# Altium project 4U_PEE_V100.PrjPcb (part 1 of 3)
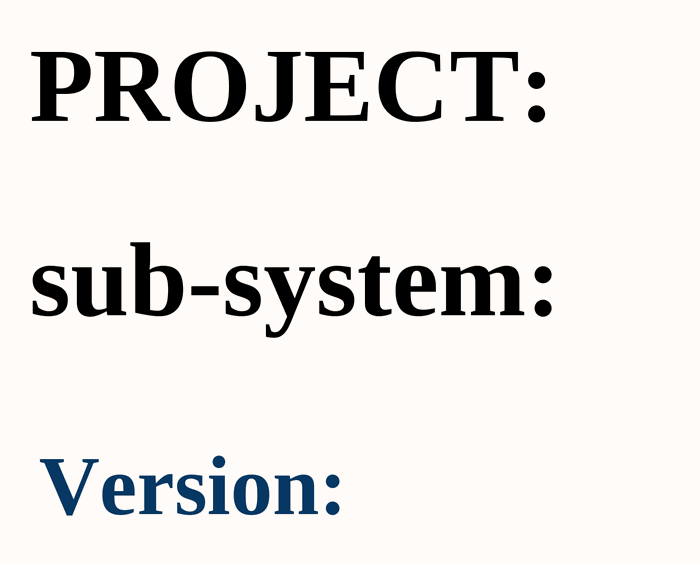
[diagram p0: 01_COVER PAGE.SchDoc]
ApprovedBy: Vu Pham; CheckedBy: Bao Bui; Date: 10/29/2025; DrawnBy: Cam Doan; MasterProject: BEE-PC; Revision: 1.0.0; SubSystem: EXP
21 sheets, 709 parts. Net scope: flat (ports and power ports of the same name join across sheets).
Board file: BEE-PC_EXP_V100.PcbDoc
Sheets:
  01_COVER PAGE.SchDoc
  02_BLOCK DIAGRAM.SchDoc
  03_INDEX.SchDoc
  04_CONNECTOR_IN.SchDoc
  04_CONNECTOR_OUT.SchDoc
  05_POWER.SchDoc
  05_POWER_2.SchDoc
  06_SOM.SchDoc
  06_SOM_USB_CARD.SchDoc
  06_SOM_Console.SchDoc
  07_eMMC.SchDoc
  07_USB.SchDoc
  08_MCU.SchDoc
  09_MRAM_RTC_WDT.SchDoc
  10_NTC_TEMPSENSOR.SchDoc
  11_HEATER.SchDoc
  12_TEC.SchDoc
  13_FLOW_Sensor.SchDoc
  14_HD4_PUMP.SchDoc
  15_SOLEDNOID.SchDoc
  MOUTING.SchDoc

## Sheet 01_COVER PAGE.SchDoc
size 420 x 297 mm; SheetNumber: 1; SheetTotal: 28

### Notes on the sheet
- PROJECT:
- sub-system:
- Version:
- Project:
- Sub-system:
- Design by:
- Sheet title:
- Sheet
- of
- Checked by:
- Approved by:
- Revision:
- Document No:
- Size:
- Date:
- A3

## Sheet 02_BLOCK DIAGRAM.SchDoc
size 420 x 297 mm; SheetNumber: 2; SheetTotal: 28

### Notes on the sheet
- Project:
- Sub-system:
- Design by:
- Sheet title:
- Sheet
- of
- Checked by:
- Approved by:
- Revision:
- Document No:
- Size:
- Date:
- A3

## Sheet 03_INDEX.SchDoc
size 420 x 297 mm; SheetNumber: 3; SheetTotal: 28
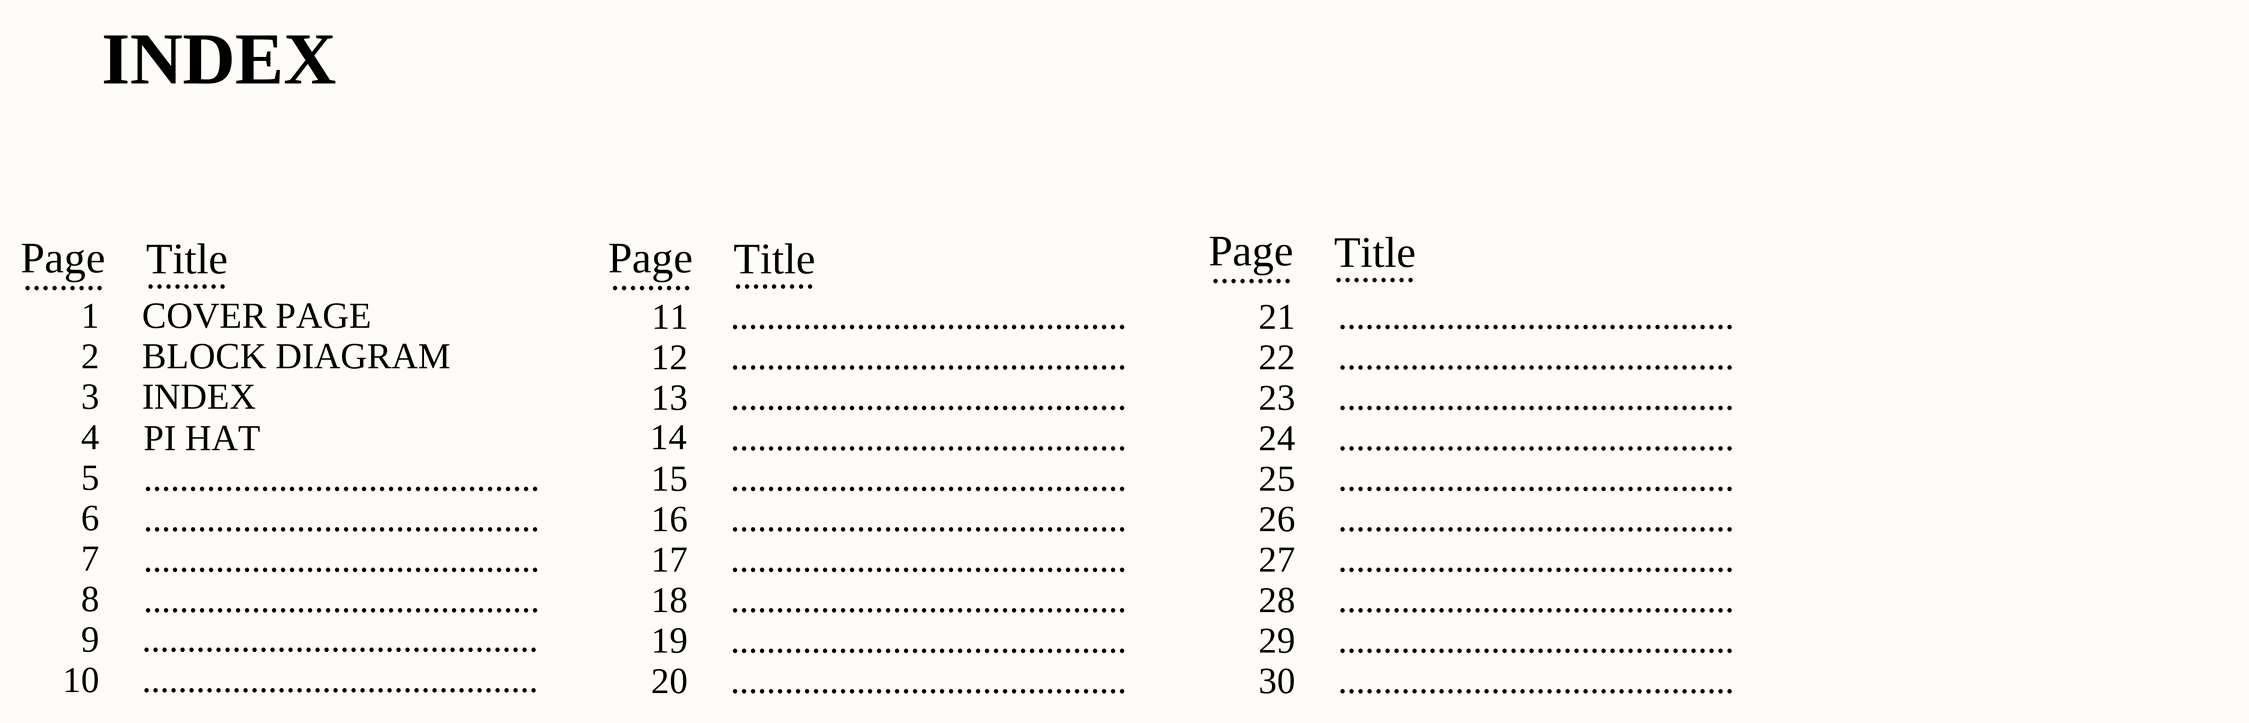
[diagram p1: 03_INDEX.SchDoc]

### Notes on the sheet
- INDEX
- Page
- .........
- Title
- 1
- 2
- COVER PAGE
- BLOCK DIAGRAM
- 11
- 12
- ............................................
- 21
- 22
- 3
- 4
- 14
- 13
- 23
- 5
- PI HAT
- 15
- 24
- 25
- 6
- 7
- 16
- 17
- 26
- 27
- 8
- 18
- 28
- 9
- 10
- 19
- 20
- 29
- 30
- Project:
- Sub-system:
- Design by:
- Sheet title:
- Sheet
- of
- Checked by:
- Approved by:
- Revision:
- Document No:
- Size:
- Date:
- A3

## Sheet 04_CONNECTOR_IN.SchDoc
size 420 x 297 mm; SheetNumber: 4; SheetTotal: 29
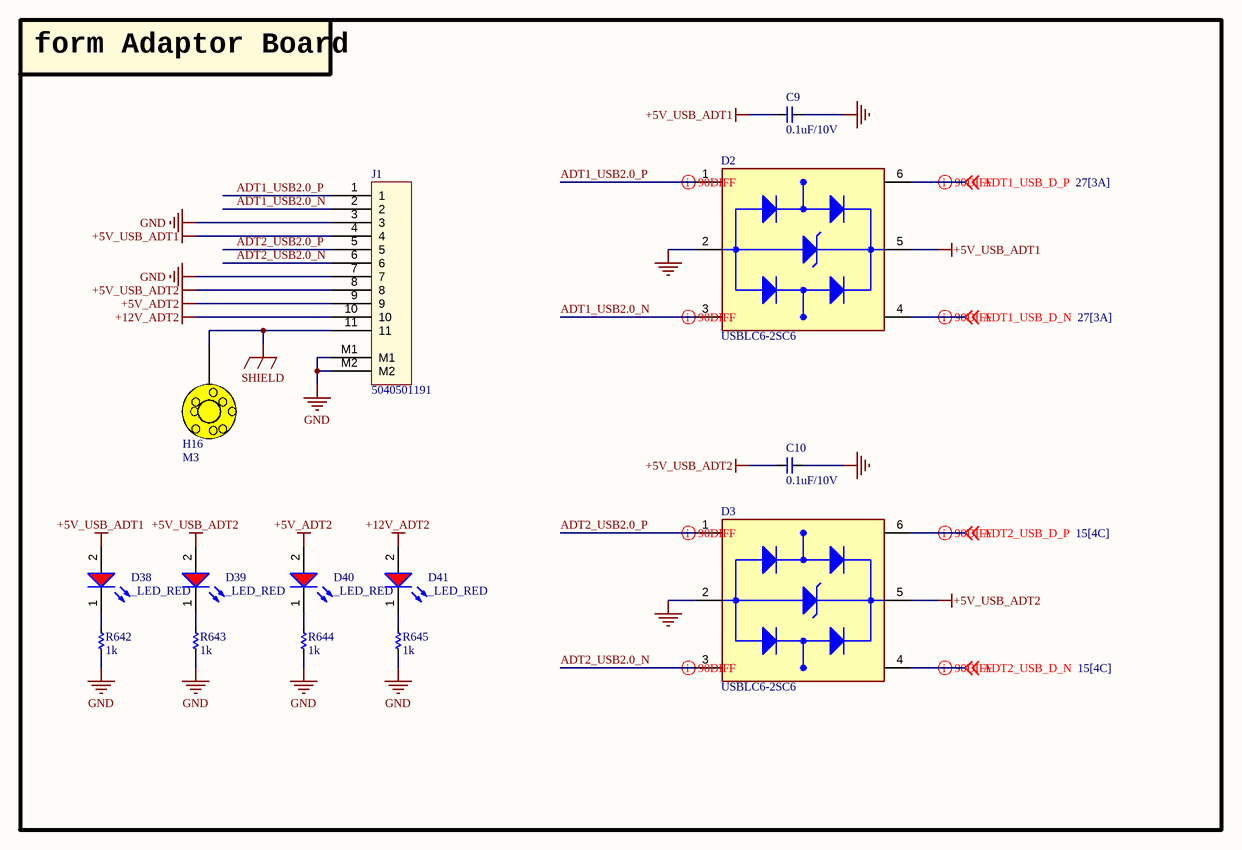
[diagram p2: 04_CONNECTOR_IN.SchDoc]

### Parts
C9  0.1uF/10V  [CAP_C_1005X60]
C10  0.1uF/10V  [CAP_C_1005X60]
D2  USBLC6-2SC6  [SOT95P280X145-6N]
D3  USBLC6-2SC6  [SOT95P280X145-6N]
D38  _LED_RED  [LED_0603]
D39  _LED_RED  [LED_0603]
D40  _LED_RED  [LED_0603]
D41  _LED_RED  [LED_0603]
H16  M3  [Testpoint_TH_D350H250]
J1  5040501191  [MOLEX_5040501191]
R642  1k  [RES_C_1005X40]
R643  1k  [RES_C_1005X40]
R644  1k  [RES_C_1005X40]
R645  1k  [RES_C_1005X40]

### Blocks framed on the sheet
form Adaptor Board: C9 C10 D2 D3 D38-D41 H16 J1 R642-R645

### Nets
+5V_ADT2: D40.2(A) J1.9
+5V_USB_ADT1: C9.2 D2.5(VBUS) D38.2(A) J1.4
+5V_USB_ADT2: C10.2 D3.5(VBUS) D39.2(A) J1.8
+12V_ADT2: D41.2(A) J1.10
GND: C9.1 C10.1 D2.2(GND) D3.2(GND) J1.3 J1.7 J1.M1 J1.M2 R642.1 R643.1 R644.1 R645.1
SHIELD: H16.1 J1.11
ADT1_USB2.0_N: D2.3(I/O2_IN) J1.2
ADT1_USB2.0_P: D2.1(I/O1_IN) J1.1
ADT1_USB_D_N: D2.4(I/O2_OUT) ; off-sheet ADT1_USB_D_N
ADT1_USB_D_P: D2.6(I/O1_OUT) ; off-sheet ADT1_USB_D_P
ADT2_USB2.0_N: D3.3(I/O2_IN) J1.6
ADT2_USB2.0_P: D3.1(I/O1_IN) J1.5
ADT2_USB_D_N: D3.4(I/O2_OUT) ; off-sheet ADT2_USB_D_N
ADT2_USB_D_P: D3.6(I/O1_OUT) ; off-sheet ADT2_USB_D_P
NetD38_1: D38.1(K) R642.2
NetD39_1: D39.1(K) R643.2
NetD40_1: D40.1(K) R644.2
NetD41_1: D41.1(K) R645.2

### Layout directives
differential pair; differential pair class DIFF90: ADT1_USB2.0_N, ADT1_USB2.0_P, ADT1_USB_D_N, ADT1_USB_D_P, ADT2_USB2.0_N, ADT2_USB2.0_P, ADT2_USB_D_N, ADT2_USB_D_P

### Notes on the sheet
- Project:
- Sub-system:
- Design by:
- Sheet title:
- Sheet
- of
- Checked by:
- Approved by:
- Revision:
- Document No:
- Size:
- Date:
- A3

### Library data of the parts
C9 C10 = _CAP_C_2: CAP CHIP
D2 D3 = USBLC6-2SC6: 17V Clamp 5A (8/20Âµs) Ipp Tvs Diode Surface Mount SOT-23-6; MF: STMicroelectronics; Value: *; SnapEDA_Link: https://www.snapeda.com/parts/USBLC6-2SC6/STMicroelectronics/view-part/?ref=snap; Check_prices: https://www.snapeda.com/parts/USBLC6-2SC6/STMicroelectronics/view-part/?ref=eda; Purchase-URL: https://pricing.snapeda.com/search/part/USBLC6-2SC6/?ref=eda; Price: None; Availability: In Stock; Package: SOT-23-6 STMicroelectronics; MP: USBLC6-2SC6
H16 = HEX-M3
J1 = Header 11x1_2M
R642-R645 = _RES_B_2: RES

## Sheet 04_CONNECTOR_OUT.SchDoc
size 420 x 297 mm; SheetNumber: 5; SheetTotal: 28
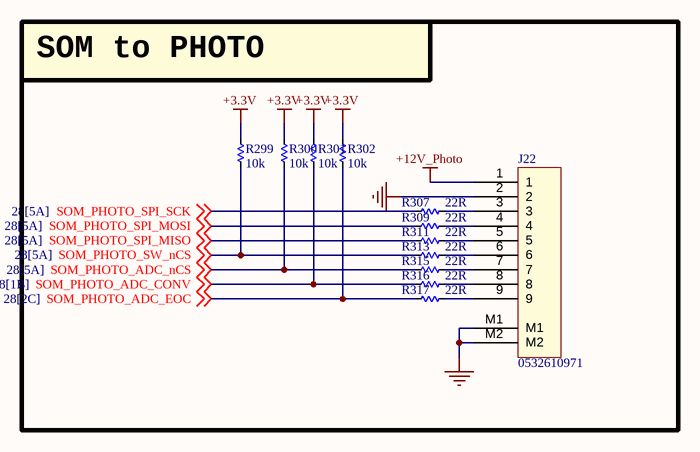
[diagram p3: 04_CONNECTOR_OUT.SchDoc]

### Parts
J22  0532610971  [MOLEX_0532610971]
R299  10k  [RES_C_1005X40]
R300  10k  [RES_C_1005X40]
R301  10k  [RES_C_1005X40]
R302  10k  [RES_C_1005X40]
R307  22R  [RES_C_1005X40]
R309  22R  [RES_C_1005X40]
R311  22R  [RES_C_1005X40]
R313  22R  [RES_C_1005X40]
R315  22R  [RES_C_1005X40]
R316  22R  [RES_C_1005X40]
R317  22R  [RES_C_1005X40]

### Blocks framed on the sheet
SOM to PHOTO: J22 R299-R302 R307 R309 R311 R313 R315-R317

### Nets
+3.3V: R299.1 R300.1 R301.1 R302.1
+12V_Photo: J22.1
GND: J22.2 J22.M1 J22.M2
SOM_PHOTO_ADC_CONV: R301.2 R316.1 ; off-sheet SOM_PHOTO_ADC_CONV
SOM_PHOTO_ADC_EOC: R302.2 R317.1 ; off-sheet SOM_PHOTO_ADC_EOC
SOM_PHOTO_ADC_nCS: R300.2 R315.1 ; off-sheet SOM_PHOTO_ADC_nCS
SOM_PHOTO_SPI_MISO: R311.1 ; off-sheet SOM_PHOTO_SPI_MISO
SOM_PHOTO_SPI_MOSI: R309.1 ; off-sheet SOM_PHOTO_SPI_MOSI
SOM_PHOTO_SPI_SCK: R307.1 ; off-sheet SOM_PHOTO_SPI_SCK
SOM_PHOTO_SW_nCS: R299.2 R313.1 ; off-sheet SOM_PHOTO_SW_nCS
NetJ22_3: J22.3 R307.2
NetJ22_4: J22.4 R309.2
NetJ22_5: J22.5 R311.2
NetJ22_6: J22.6 R313.2
NetJ22_7: J22.7 R315.2
NetJ22_8: J22.8 R316.2
NetJ22_9: J22.9 R317.2

### Notes on the sheet
- Project:
- Sub-system:
- Design by:
- Sheet title:
- Sheet
- of
- Checked by:
- Approved by:
- Revision:
- Document No:
- Size:
- Date:
- A3

### Library data of the parts
J22 = Header 9x1_2M
R299-R302 R307 R309 R311 R313 R315-R317 = _RES_B_2: RES

## Sheet 05_POWER.SchDoc
size 420 x 297 mm; SheetNumber: 7; SheetTotal: 28
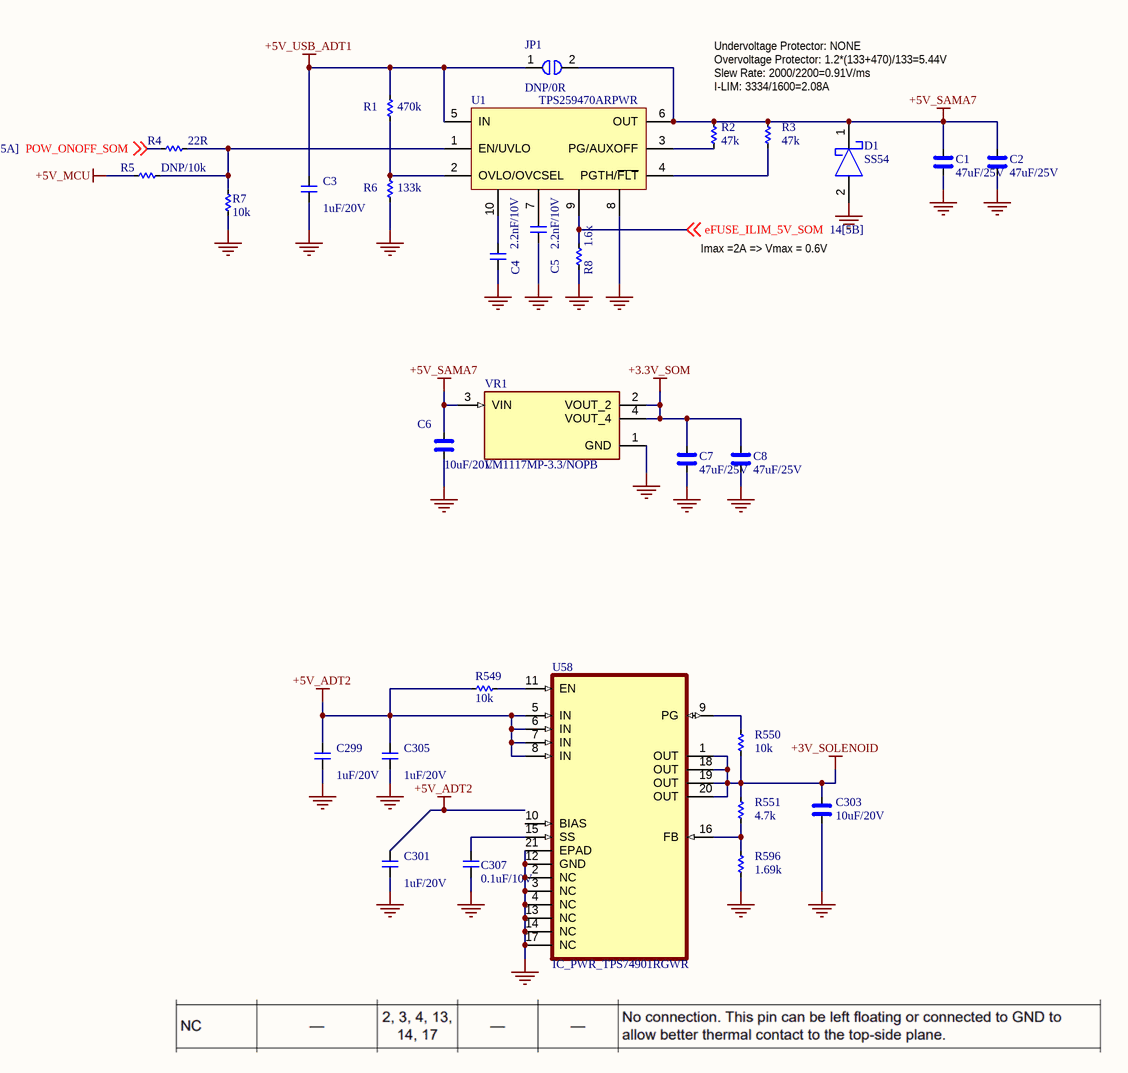
[diagram p4: 05_POWER.SchDoc]

### Parts
C1  47uF/25V  [CAP_C_3225X80]
C2  47uF/25V  [CAP_C_3225X80]
C3  1uF/20V  [CAP_C_1005X60]
C4  2.2nF/10V  [CAP_C_1005X60]
C5  2.2nF/10V  [CAP_C_1005X60]
C6  10uF/20V  [CAP_C_2012X110]
C7  47uF/25V  [CAP_C_3225X80]
C8  47uF/25V  [CAP_C_3225X80]
C299  1uF/20V  [CAP_C_1005X60]
C301  1uF/20V  [CAP_C_1005X60]
C303  10uF/20V  [CAP_C_2012X110]
C305  1uF/20V  [CAP_C_1005X60]
C307  0.1uF/10V  [CAP_C_1005X60]
D1  SS54  [DO-214AC_SMA]
JP1  DNP/0R  [RES_C_1608X60]
R1  470k  [RES_C_1005X40]
R2  47k  [RES_C_1005X40]
R3  47k  [RES_C_1005X40]
R4  22R  [RES_C_1005X40]
R5  DNP/10k  [RES_C_1005X40]
R6  133k  [RES_C_1005X40]
R7  10k  [RES_C_1005X40]
R8  1.6k  [RES_C_1005X40]
R549  10k  [RES_C_1005X40]
R550  10k  [RES_C_1005X40]
R551  4.7k  [RES_C_1005X40]
R596  1.69k  [RES_C_1005X40]
U1  TPS259470ARPWR  [VQFN-HR-10]
U58  IC_PWR_TPS74901RGWR  [QFN65P500X500X100-21N]
VR1  LM1117MP-3.3/NOPB  [VREG_LM1117MP-3.3/NOPB]

### Nets
+3.3V_SOM: C7.2 C8.2 VR1.2(VOUT_2) VR1.4(VOUT_4)
+3V_SOLENOID: C303.1 R550.1 R551.2 U58.1(OUT) U58.18(OUT) U58.19(OUT) U58.20(OUT)
+5V_ADT2: C299.2 C301.2 C305.2 R549.2 U58.5(IN) U58.6(IN) U58.7(IN) U58.8(IN)
+5V_MCU: R5.2
+5V_SAMA7: C1.2 C2.2 C6.1 D1.1 JP1.2 R2.2 R3.2 U1.6(OUT) VR1.3(VIN)
+5V_USB_ADT1: C3.2 JP1.1 R1.2 U1.5(IN)
GND: C1.1 C2.1 C3.1 C4.1 C5.1 C6.2 C7.1 C8.1 C299.1 C301.1 C303.2 C305.1 C307.1 D1.2 R6.1 R7.2 R8.1 R596.1 U1.8 U58.2(NC) U58.3(NC) U58.4(NC) U58.12(GND) U58.13(NC) U58.14(NC) U58.17(NC) U58.21(EPAD) VR1.1(GND)
eFUSE_ILIM_5V_SOM: R8.2 U1.9 ; off-sheet eFUSE_ILIM_5V_SOM
POW_ONOFF_SOM: R4.2 ; off-sheet POW_ONOFF_SOM
NetC4_2: C4.2 U1.10
NetC5_2: C5.2 U1.7
NetC307_2: C307.2 U58.15(SS)
NetR1_1: R1.1 R6.2 U1.2(OVLO/OVCSEL)
NetR2_1: R2.1 U1.3(PG/AUXOFF)
NetR3_1: R3.1 U1.4(PGTH/~{FLT})
NetR4_1: R4.1 R5.1 R7.1 U1.1(EN/UVLO)
NetR549_1: R549.1 U58.11(EN)
NetR550_2: R550.2 U58.9(PG)
NetR551_1: R551.1 R596.2 U58.16(FB)

Not connected (* = marked no-connect by the designer): U58 10(BIAS)

### Notes on the sheet
- Undervoltage Protector: NONE
- Overvoltage Protector: 1.2*(133+470)/133=5.44V
- Slew Rate: 2000/2200=0.91V/ms
- I-LIM: 3334/1600=2.08A
- Imax =2A => Vmax = 0.6V
- Project:
- Sub-system:
- Design by:
- Sheet title:
- Sheet
- of
- Checked by:
- Approved by:
- Revision:
- Document No:
- Size:
- Date:
- A3

### Library data of the parts
C1 C2 C6-C8 C303 = _CAP_C_High_2: CAP CHIP High Value
C3-C5 C299 C301 C305 C307 = _CAP_C_2: CAP CHIP
D1 = SS54: DIODE SCHOTTKY 60V 3A DO214AA
JP1 = JUMPER_1_1
R1-R8 R549-R551 R596 = _RES_B_2: RES
U58 = IC_PWR_TPS74901RGWR: 3-A, low-VIN (0.8-V), adjustable ultra-low-dropout voltage regulator with power good & enable 20-VQFN -40 to 125; MF: Texas Instruments; Price: None; Check_prices: https://www.snapeda.com/parts/TPS74901RGWR/Texas%20Instruments/view-part/1101342/?ref=eda; SnapEDA_Link: https://www.snapeda.com/parts/TPS74901RGWR/Texas%20Instruments/view-part/1101342/?ref=snap; Package: VQFN-20 Texas Instruments; Purchase-URL: https://pricing.snapeda.com/search/part/TPS74901RGWR/?ref=eda; Availability: Good; MP: TPS74901RGWR; Value: *
VR1 = LM1117MP-3.3/NOPB: 800-mA 15-V linear voltage regulator; MF: Texas Instruments; SnapEDA_Link: https://www.snapeda.com/parts/LM1117MP-3.3/NOPB/Texas+Instruments/view-part/?ref=snap; Package: SOT-223-4 Texas Instruments; Value: *; MP: LM1117MP-3.3/NOPB; Check_prices: https://www.snapeda.com/parts/LM1117MP-3.3/NOPB/Texas+Instruments/view-part/?ref=eda

## Sheet 05_POWER_2.SchDoc
size 420 x 297 mm; SheetNumber: 8; SheetTotal: 28
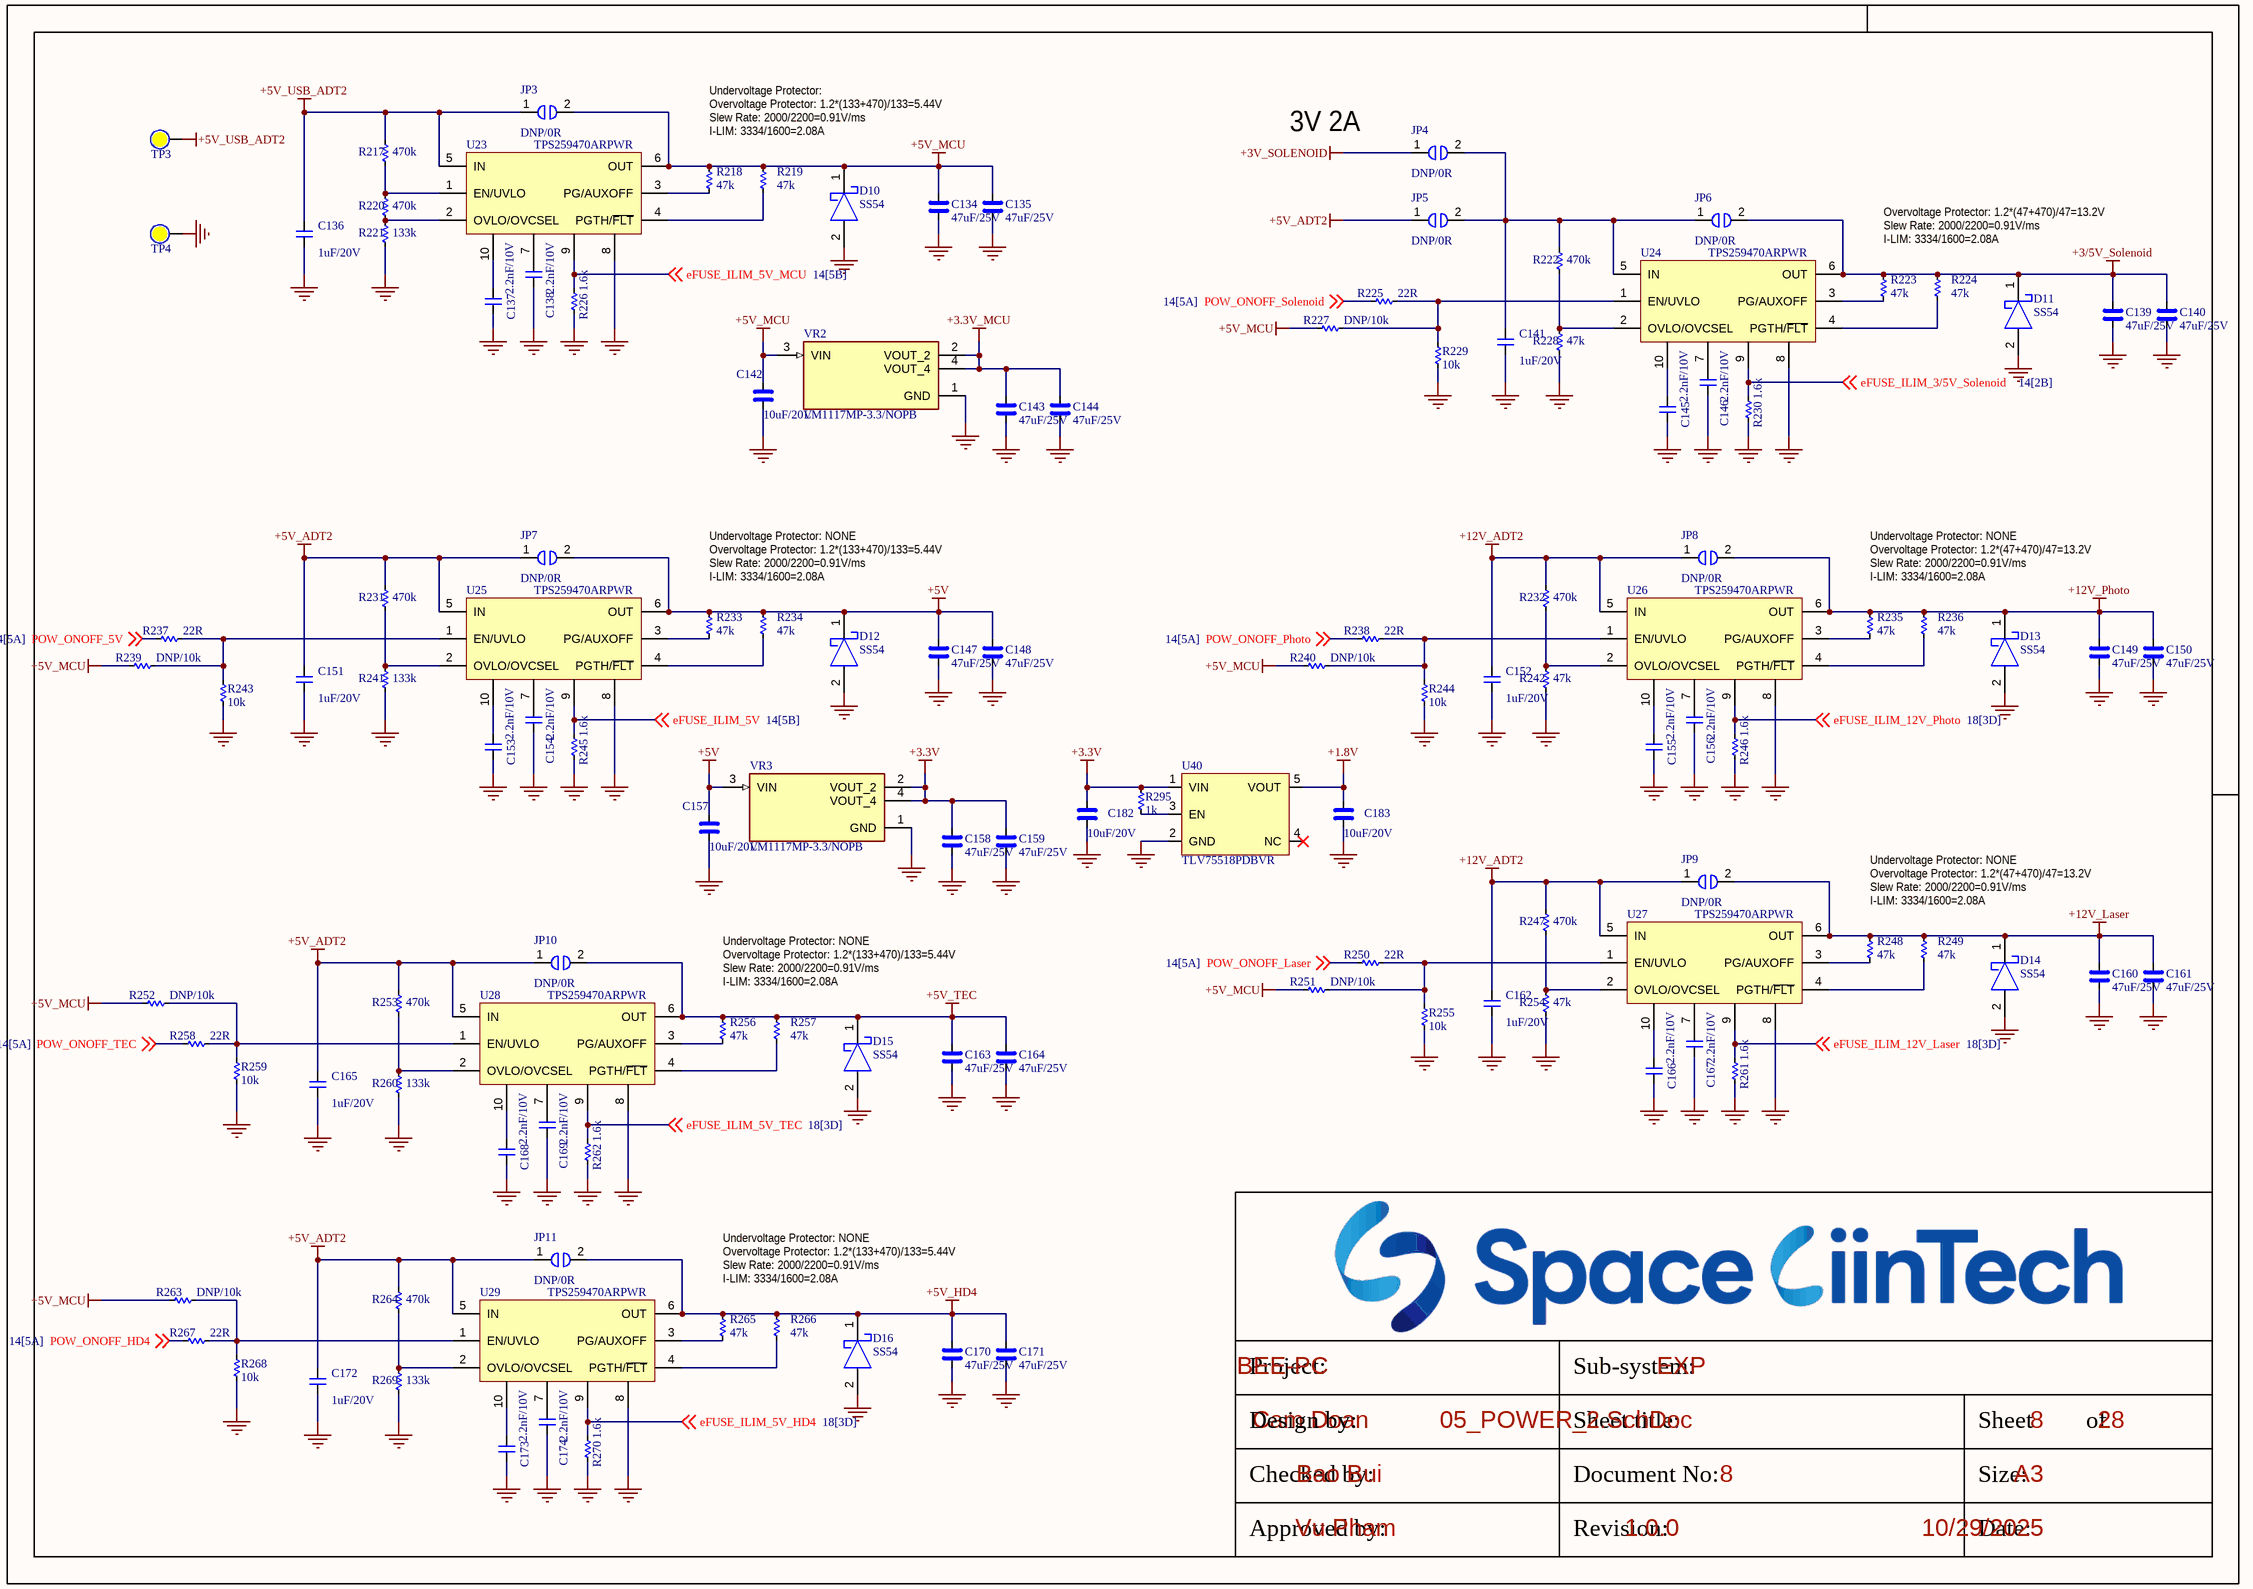
[diagram p5: 05_POWER_2.SchDoc]

### Parts
C134  47uF/25V  [CAP_C_3225X80]
C135  47uF/25V  [CAP_C_3225X80]
C136  1uF/20V  [CAP_C_1005X60]
C137  2.2nF/10V  [CAP_C_1005X60]
C138  2.2nF/10V  [CAP_C_1005X60]
C139  47uF/25V  [CAP_C_3225X80]
C140  47uF/25V  [CAP_C_3225X80]
C141  1uF/20V  [CAP_C_1005X60]
C142  10uF/20V  [CAP_C_2012X110]
C143  47uF/25V  [CAP_C_3225X80]
C144  47uF/25V  [CAP_C_3225X80]
C145  2.2nF/10V  [CAP_C_1005X60]
C146  2.2nF/10V  [CAP_C_1005X60]
C147  47uF/25V  [CAP_C_3225X80]
C148  47uF/25V  [CAP_C_3225X80]
C149  47uF/25V  [CAP_C_3225X80]
C150  47uF/25V  [CAP_C_3225X80]
C151  1uF/20V  [CAP_C_1005X60]
C152  1uF/20V  [CAP_C_1005X60]
C153  2.2nF/10V  [CAP_C_1005X60]
C154  2.2nF/10V  [CAP_C_1005X60]
C155  2.2nF/10V  [CAP_C_1005X60]
C156  2.2nF/10V  [CAP_C_1005X60]
C157  10uF/20V  [CAP_C_2012X110]
C158  47uF/25V  [CAP_C_3225X80]
C159  47uF/25V  [CAP_C_3225X80]
C160  47uF/25V  [CAP_C_3225X80]
C161  47uF/25V  [CAP_C_3225X80]
C162  1uF/20V  [CAP_C_1005X60]
C163  47uF/25V  [CAP_C_3225X80]
C164  47uF/25V  [CAP_C_3225X80]
C165  1uF/20V  [CAP_C_1005X60]
C166  2.2nF/10V  [CAP_C_1005X60]
C167  2.2nF/10V  [CAP_C_1005X60]
C168  2.2nF/10V  [CAP_C_1005X60]
C169  2.2nF/10V  [CAP_C_1005X60]
C170  47uF/25V  [CAP_C_3225X80]
C171  47uF/25V  [CAP_C_3225X80]
C172  1uF/20V  [CAP_C_1005X60]
C173  2.2nF/10V  [CAP_C_1005X60]
C174  2.2nF/10V  [CAP_C_1005X60]
C182  10uF/20V  [CAP_C_2012X110]
C183  10uF/20V  [CAP_C_2012X110]
D10  SS54  [DO-214AC_SMA]
D11  SS54  [DO-214AC_SMA]
D12  SS54  [DO-214AC_SMA]
D13  SS54  [DO-214AC_SMA]
D14  SS54  [DO-214AC_SMA]
D15  SS54  [DO-214AC_SMA]
D16  SS54  [DO-214AC_SMA]
JP3  DNP/0R  [RES_C_1608X60]
JP4  DNP/0R  [RES_C_1608X60]
JP5  DNP/0R  [RES_C_1608X60]
JP6  DNP/0R  [RES_C_1608X60]
JP7  DNP/0R  [RES_C_1608X60]
JP8  DNP/0R  [RES_C_1608X60]
JP9  DNP/0R  [RES_C_1608X60]
JP10  DNP/0R  [RES_C_1608X60]
JP11  DNP/0R  [RES_C_1608X60]
R217  470k  [RES_C_1005X40]
R218  47k  [RES_C_1005X40]
R219  47k  [RES_C_1005X40]
R220  470k  [RES_C_1005X40]
R221  133k  [RES_C_1005X40]
R222  470k  [RES_C_1005X40]
R223  47k  [RES_C_1005X40]
R224  47k  [RES_C_1005X40]
R225  22R  [RES_C_1005X40]
R226  1.6k  [RES_C_1005X40]
R227  DNP/10k  [RES_C_1005X40]
R228  47k  [RES_C_1005X40]
R229  10k  [RES_C_1005X40]
R230  1.6k  [RES_C_1005X40]
R231  470k  [RES_C_1005X40]
R232  470k  [RES_C_1005X40]
R233  47k  [RES_C_1005X40]
R234  47k  [RES_C_1005X40]
R235  47k  [RES_C_1005X40]
R236  47k  [RES_C_1005X40]
R237  22R  [RES_C_1005X40]
R238  22R  [RES_C_1005X40]
R239  DNP/10k  [RES_C_1005X40]
R240  DNP/10k  [RES_C_1005X40]
R241  133k  [RES_C_1005X40]
R242  47k  [RES_C_1005X40]
R243  10k  [RES_C_1005X40]
R244  10k  [RES_C_1005X40]
R245  1.6k  [RES_C_1005X40]
R246  1.6k  [RES_C_1005X40]
R247  470k  [RES_C_1005X40]
R248  47k  [RES_C_1005X40]
R249  47k  [RES_C_1005X40]
R250  22R  [RES_C_1005X40]
R251  DNP/10k  [RES_C_1005X40]
R252  DNP/10k  [RES_C_1005X40]
R253  470k  [RES_C_1005X40]
R254  47k  [RES_C_1005X40]
R255  10k  [RES_C_1005X40]
R256  47k  [RES_C_1005X40]
R257  47k  [RES_C_1005X40]
R258  22R  [RES_C_1005X40]
R259  10k  [RES_C_1005X40]
R260  133k  [RES_C_1005X40]
R261  1.6k  [RES_C_1005X40]
R262  1.6k  [RES_C_1005X40]
R263  DNP/10k  [RES_C_1005X40]
R264  470k  [RES_C_1005X40]
R265  47k  [RES_C_1005X40]
R266  47k  [RES_C_1005X40]
R267  22R  [RES_C_1005X40]
R268  10k  [RES_C_1005X40]
R269  133k  [RES_C_1005X40]
R270  1.6k  [RES_C_1005X40]
R295  1k  [RES_C_1005X40]
TP3  (no value)  [Testpoint_TH_D130H80]  (no BOM)
TP4  (no value)  [Testpoint_TH_D130H80]  (no BOM)
U23  TPS259470ARPWR  [VQFN-HR-10]
U24  TPS259470ARPWR  [VQFN-HR-10]
U25  TPS259470ARPWR  [VQFN-HR-10]
U26  TPS259470ARPWR  [VQFN-HR-10]
U27  TPS259470ARPWR  [VQFN-HR-10]
U28  TPS259470ARPWR  [VQFN-HR-10]
U29  TPS259470ARPWR  [VQFN-HR-10]
U40  TLV75518PDBVR  [SOT25]
VR2  LM1117MP-3.3/NOPB  [VREG_LM1117MP-3.3/NOPB]
VR3  LM1117MP-3.3/NOPB  [VREG_LM1117MP-3.3/NOPB]

### Nets
+1.8V: C183.1 U40.5(VOUT)
+3.3V: C158.2 C159.2 C182.1 R295.2 U40.1(VIN) VR3.2(VOUT_2) VR3.4(VOUT_4)
+3.3V_MCU: C143.2 C144.2 VR2.2(VOUT_2) VR2.4(VOUT_4)
+3/5V_Solenoid: C139.2 C140.2 D11.1 JP6.2 R223.2 R224.2 U24.6(OUT)
+3V_SOLENOID: JP4.1
+5V: C147.2 C148.2 C157.1 D12.1 JP7.2 R233.2 R234.2 U25.6(OUT) VR3.3(VIN)
+5V_ADT2: C151.2 C165.2 C172.2 JP5.1 JP7.1 JP10.1 JP11.1 R231.2 R253.2 R264.2 U25.5(IN) U28.5(IN) U29.5(IN)
+5V_HD4: C170.2 C171.2 D16.1 JP11.2 R265.2 R266.2 U29.6(OUT)
+5V_MCU: C134.2 C135.2 C142.1 D10.1 JP3.2 R218.2 R219.2 R227.2 R239.2 R240.2 R251.2 R252.2 R263.2 U23.6(OUT) VR2.3(VIN)
+5V_TEC: C163.2 C164.2 D15.1 JP10.2 R256.2 R257.2 U28.6(OUT)
+5V_USB_ADT2: C136.2 JP3.1 R217.2 TP3.0 U23.5(IN)
+12V_ADT2: C152.2 C162.2 JP8.1 JP9.1 R232.2 R247.2 U26.5(IN) U27.5(IN)
+12V_Laser: C160.2 C161.2 D14.1 JP9.2 R248.2 R249.2 U27.6(OUT)
+12V_Photo: C149.2 C150.2 D13.1 JP8.2 R235.2 R236.2 U26.6(OUT)
GND: C134.1 C135.1 C136.1 C137.1 C138.1 C139.1 C140.1 C141.1 C142.2 C143.1 C144.1 C145.1 C146.1 C147.1 C148.1 C149.1 C150.1 C151.1 C152.1 C153.1 C154.1 C155.1 C156.1 C157.2 C158.1 C159.1 C160.1 C161.1 C162.1 C163.1 C164.1 C165.1 C166.1 C167.1 C168.1 C169.1 C170.1 C171.1 C172.1 C173.1 C174.1 C182.2 C183.2 D10.2 D11.2 D12.2 D13.2 D14.2 D15.2 D16.2 R221.1 R226.1 R228.1 R229.2 R230.1 R241.1 R242.1 R243.2 R244.2 R245.1 R246.1 R254.1 R255.2 R259.2 R260.1 R261.1 R262.1 R268.2 R269.1 R270.1 TP4.0 U23.8 U24.8 U25.8 U26.8 U27.8 U28.8 U29.8 U40.2(GND) VR2.1(GND) VR3.1(GND)
eFUSE_ILIM_3/5V_Solenoid: R230.2 U24.9 ; off-sheet eFUSE_ILIM_3/5V_Solenoid
eFUSE_ILIM_5V: R245.2 U25.9 ; off-sheet eFUSE_ILIM_5V
eFUSE_ILIM_5V_HD4: R270.2 U29.9 ; off-sheet eFUSE_ILIM_5V_HD4
eFUSE_ILIM_5V_MCU: R226.2 U23.9 ; off-sheet eFUSE_ILIM_5V_MCU
eFUSE_ILIM_5V_TEC: R262.2 U28.9 ; off-sheet eFUSE_ILIM_5V_TEC
eFUSE_ILIM_12V_Laser: R261.2 U27.9 ; off-sheet eFUSE_ILIM_12V_Laser
eFUSE_ILIM_12V_Photo: R246.2 U26.9 ; off-sheet eFUSE_ILIM_12V_Photo
POW_ONOFF_5V: R237.2 ; off-sheet POW_ONOFF_5V
POW_ONOFF_HD4: R267.2 ; off-sheet POW_ONOFF_HD4
POW_ONOFF_Laser: R250.2 ; off-sheet POW_ONOFF_Laser
POW_ONOFF_Photo: R238.2 ; off-sheet POW_ONOFF_Photo
POW_ONOFF_Solenoid: R225.2 ; off-sheet POW_ONOFF_Solenoid
POW_ONOFF_TEC: R258.2 ; off-sheet POW_ONOFF_TEC
NetC137_2: C137.2 U23.10
NetC138_2: C138.2 U23.7
NetC141_2: C141.2 JP4.2 JP5.2 JP6.1 R222.2 U24.5(IN)
NetC145_2: C145.2 U24.10
NetC146_2: C146.2 U24.7
NetC153_2: C153.2 U25.10
NetC154_2: C154.2 U25.7
NetC155_2: C155.2 U26.10
NetC156_2: C156.2 U26.7
NetC166_2: C166.2 U27.10
NetC167_2: C167.2 U27.7
NetC168_2: C168.2 U28.10
NetC169_2: C169.2 U28.7
NetC173_2: C173.2 U29.10
NetC174_2: C174.2 U29.7
NetR217_1: R217.1 R220.2 U23.1(EN/UVLO)
NetR218_1: R218.1 U23.3(PG/AUXOFF)
NetR219_1: R219.1 U23.4(PGTH/~{FLT})
NetR220_1: R220.1 R221.2 U23.2(OVLO/OVCSEL)
NetR222_1: R222.1 R228.2 U24.2(OVLO/OVCSEL)
NetR223_1: R223.1 U24.3(PG/AUXOFF)
NetR224_1: R224.1 U24.4(PGTH/~{FLT})
NetR225_1: R225.1 R227.1 R229.1 U24.1(EN/UVLO)
NetR231_1: R231.1 R241.2 U25.2(OVLO/OVCSEL)
NetR232_1: R232.1 R242.2 U26.2(OVLO/OVCSEL)
NetR233_1: R233.1 U25.3(PG/AUXOFF)
NetR234_1: R234.1 U25.4(PGTH/~{FLT})
NetR235_1: R235.1 U26.3(PG/AUXOFF)
NetR236_1: R236.1 U26.4(PGTH/~{FLT})
NetR237_1: R237.1 R239.1 R243.1 U25.1(EN/UVLO)
NetR238_1: R238.1 R240.1 R244.1 U26.1(EN/UVLO)
NetR247_1: R247.1 R254.2 U27.2(OVLO/OVCSEL)
NetR248_1: R248.1 U27.3(PG/AUXOFF)
NetR249_1: R249.1 U27.4(PGTH/~{FLT})
NetR250_1: R250.1 R251.1 R255.1 U27.1(EN/UVLO)
NetR252_1: R252.1 R258.1 R259.1 U28.1(EN/UVLO)
NetR253_1: R253.1 R260.2 U28.2(OVLO/OVCSEL)
NetR256_1: R256.1 U28.3(PG/AUXOFF)
NetR257_1: R257.1 U28.4(PGTH/~{FLT})
NetR263_1: R263.1 R267.1 R268.1 U29.1(EN/UVLO)
NetR264_1: R264.1 R269.2 U29.2(OVLO/OVCSEL)
NetR265_1: R265.1 U29.3(PG/AUXOFF)
NetR266_1: R266.1 U29.4(PGTH/~{FLT})
NetR295_1: R295.1 U40.3(EN)

Not connected (* = marked no-connect by the designer): U40 4(NC)*

### Notes on the sheet
- Undervoltage Protector:
- Overvoltage Protector: 1.2*(133+470)/133=5.44V
- Slew Rate: 2000/2200=0.91V/ms
- I-LIM: 3334/1600=2.08A
- 3V 2A
- Overvoltage Protector: 1.2*(47+470)/47=13.2V
- Undervoltage Protector: NONE
- Project:
- Sub-system:
- Design by:
- Sheet title:
- Sheet
- of
- Checked by:
- Approved by:
- Revision:
- Document No:
- Size:
- Date:
- A3

### Library data of the parts
C134 C135 C139 C140 C142-C144 C147-C150 C157-C161 C163 C164 C170 C171 C182 C183 = _CAP_C_High_2: CAP CHIP High Value
C136-C138 C141 C145 C146 C151-C156 C162 C165-C169 C172-C174 = _CAP_C_2: CAP CHIP
D10-D16 = SS54: DIODE SCHOTTKY 60V 3A DO214AA
JP3-JP11 = JUMPER_1_1
R217-R270 R295 = _RES_B_2: RES
TP3 TP4 = Test Point: Solder: NF
U40 = IC_POWER_AP7347DQ
VR2 VR3 = LM1117MP-3.3/NOPB: as VR1 on sheet 05_POWER; SnapEDA_Link: https://www.snapeda.com/parts/LM1117MP-3.3/NOPB/Texas+Instruments/view-part/?ref=snap; Package: SOT-223-4 Texas Instruments; Value: *; MP: LM1117MP-3.3/NOPB; Check_prices: https://www.snapeda.com/parts/LM1117MP-3.3/NOPB/Texas+Instruments/view-part/?ref=eda

## Sheet 06_SOM.SchDoc
size 420 x 297 mm; SheetNumber: 9; SheetTotal: 29
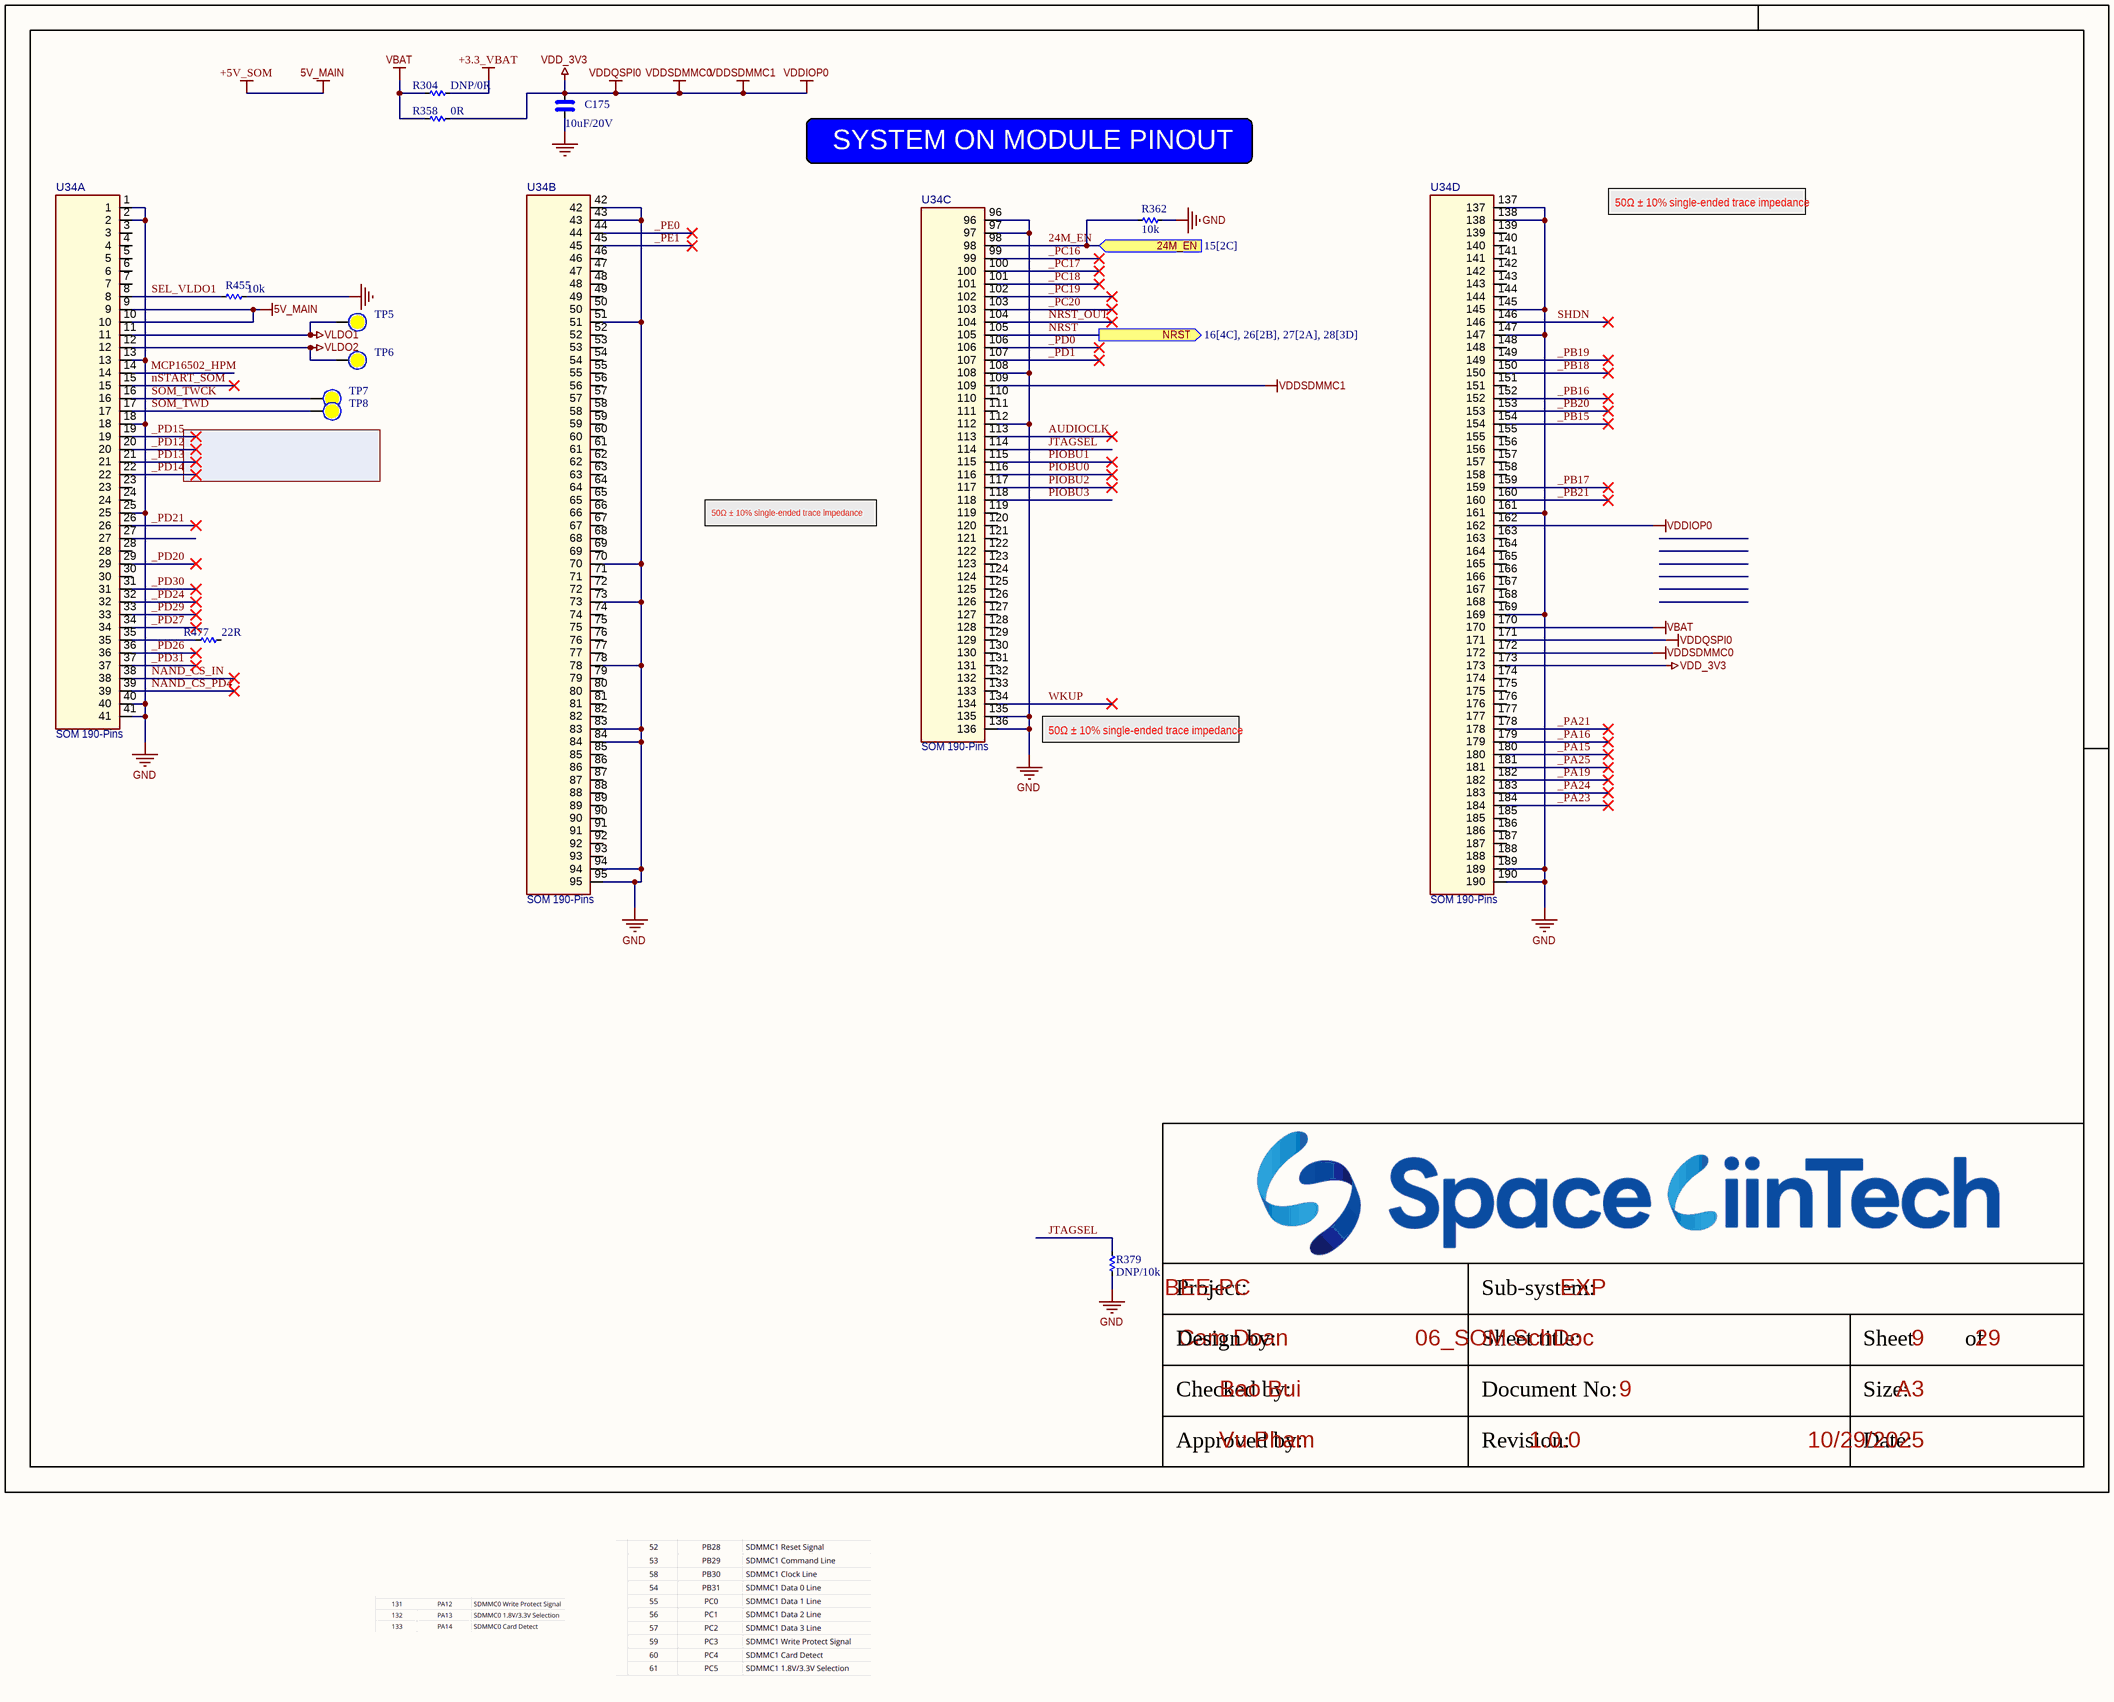
[diagram p6: 06_SOM.SchDoc]

### Parts
C175  10uF/20V  [CAP_C_2012X110]
R304  DNP/0R  [RES_C_1005X40]
R358  0R  [RES_C_1005X40]
R362  10k  [RES_C_1005X40]
R379  DNP/10k  [RES_C_1005X40]
R455  10k  [RES_C_1005X40]
R477  22R  [RES_C_1005X40]
TP5  (no value)  [Testpoint_TH_D130H80]  (no BOM)
TP6  (no value)  [Testpoint_TH_D130H80]  (no BOM)
TP7  (no value)  [Testpoint_TH_D130H80]  (no BOM)
TP8  (no value)  [Testpoint_TH_D130H80]  (no BOM)
U34  SOM 190-Pins  [SOM-38MMX30MM]  (parts A,B,C,D of 4)  (no BOM)

### Ports
24M_EN (in, see 15[2C]), NRST (out, see 16[4C], 26[2B], 27[2A], 28[3D])

### Nets
+3.3_VBAT: R304.1
+5V_SOM: U34.9 U34.10  [also labelled 5V_MAIN]
GND: C175.2 R362.1 R379.1 R455.1 U34.1 U34.2 U34.13 U34.18 U34.25 U34.40 U34.41 U34.42 U34.43 U34.51 U34.70 U34.73 U34.78 U34.83 U34.84 U34.94 U34.95 U34.96 U34.97 U34.108 U34.112 U34.135 U34.136 U34.137 U34.138 U34.145 U34.147 U34.161 U34.169 U34.189 U34.190
VBAT: R304.2 R358.2 U34.170
VDD_3V3: C175.1 R358.1 U34.109 U34.162 U34.171 U34.172 U34.173  [also labelled VDDIOP0, VDDQSPI0, VDDSDMMC0, VDDSDMMC1]
VLDO1: TP5.0 U34.11
VLDO2: TP6.0 U34.12
24M_EN: R362.2 U34.98 ; port 24M_EN
_PA15: U34.180
_PA16: U34.179
_PA19: U34.182
_PA21: U34.178
_PA23: U34.184
_PA24: U34.183
_PA25: U34.181
_PB15: U34.154
_PB16: U34.152
_PB17: U34.159
_PB18: U34.150
_PB19: U34.149
_PB20: U34.153
_PB21: U34.160
_PC16: U34.99
_PC17: U34.100
_PC18: U34.101
_PC19: U34.102
_PC20: U34.103
_PD0: U34.106
_PD1: U34.107
_PD12: U34.20
_PD13: U34.21
_PD14: U34.22
_PD15: U34.19
_PD20: U34.29
_PD21: U34.26
_PD24: U34.32
_PD26: U34.36
_PD27: U34.34
_PD29: U34.33
_PD30: U34.31
_PD31: U34.37
_PE0: U34.44
_PE1: U34.45
AUDIOCLK: U34.113
JTAGSEL: R379.2 U34.114
MCP16502_HPM: U34.14
NAND_CS_IN: U34.38
NAND_CS_PD4: U34.39
NRST: U34.105 ; port NRST
NRST_OUT: U34.104
nSTART_SOM: U34.15
PIOBU0: U34.116
PIOBU1: U34.115
PIOBU2: U34.117
PIOBU3: U34.118
SEL_VLDO1: R455.2 U34.8
SHDN: U34.146
SOM_TWCK: TP7.0 U34.16
SOM_TWD: TP8.0 U34.17
WKUP: U34.134
NetR477_2: R477.2 U34.35

Not connected (* = marked no-connect by the designer): R477 1; U34 3 4 5 6 7 23 24 27 28 30 46 47 48 49 50 52 53 54 55 56 57 58 59 60 61 62 63 64 65 66 67 68 69 71 72 74 75 76 77 79 80 81 82 85 86 87 88 89 90 91 92 93 110 111 119 120 121 122 123 124 125 126 127 128 129 130 131 132 133 139 140 141 142 143 144 148 151 155 156 157 158 163 164 165 166 167 168 174 175 176 177 185 186 187 188

### Notes on the sheet
- SYSTEM ON MODULE PINOUT
- 50Ω ± 10% single-ended trace impedance
- Project:
- Sub-system:
- Design by:
- Sheet title:
- Sheet
- of
- Checked by:
- Approved by:
- Revision:
- Document No:
- Size:
- Date:
- A3

### Library data of the parts
C175 = _CAP_C_High_2: CAP CHIP High Value
R304 R358 R362 R379 R455 R477 = _RES_B_2: RES
TP5-TP8 = Test Point: Solder: NF
U34 = SOM-190: 190-Castellated thru-holes, 38mm x 30mm package

## Sheet 06_SOM_USB_CARD.SchDoc
size 420 x 297 mm; SheetNumber: 10; SheetTotal: 29
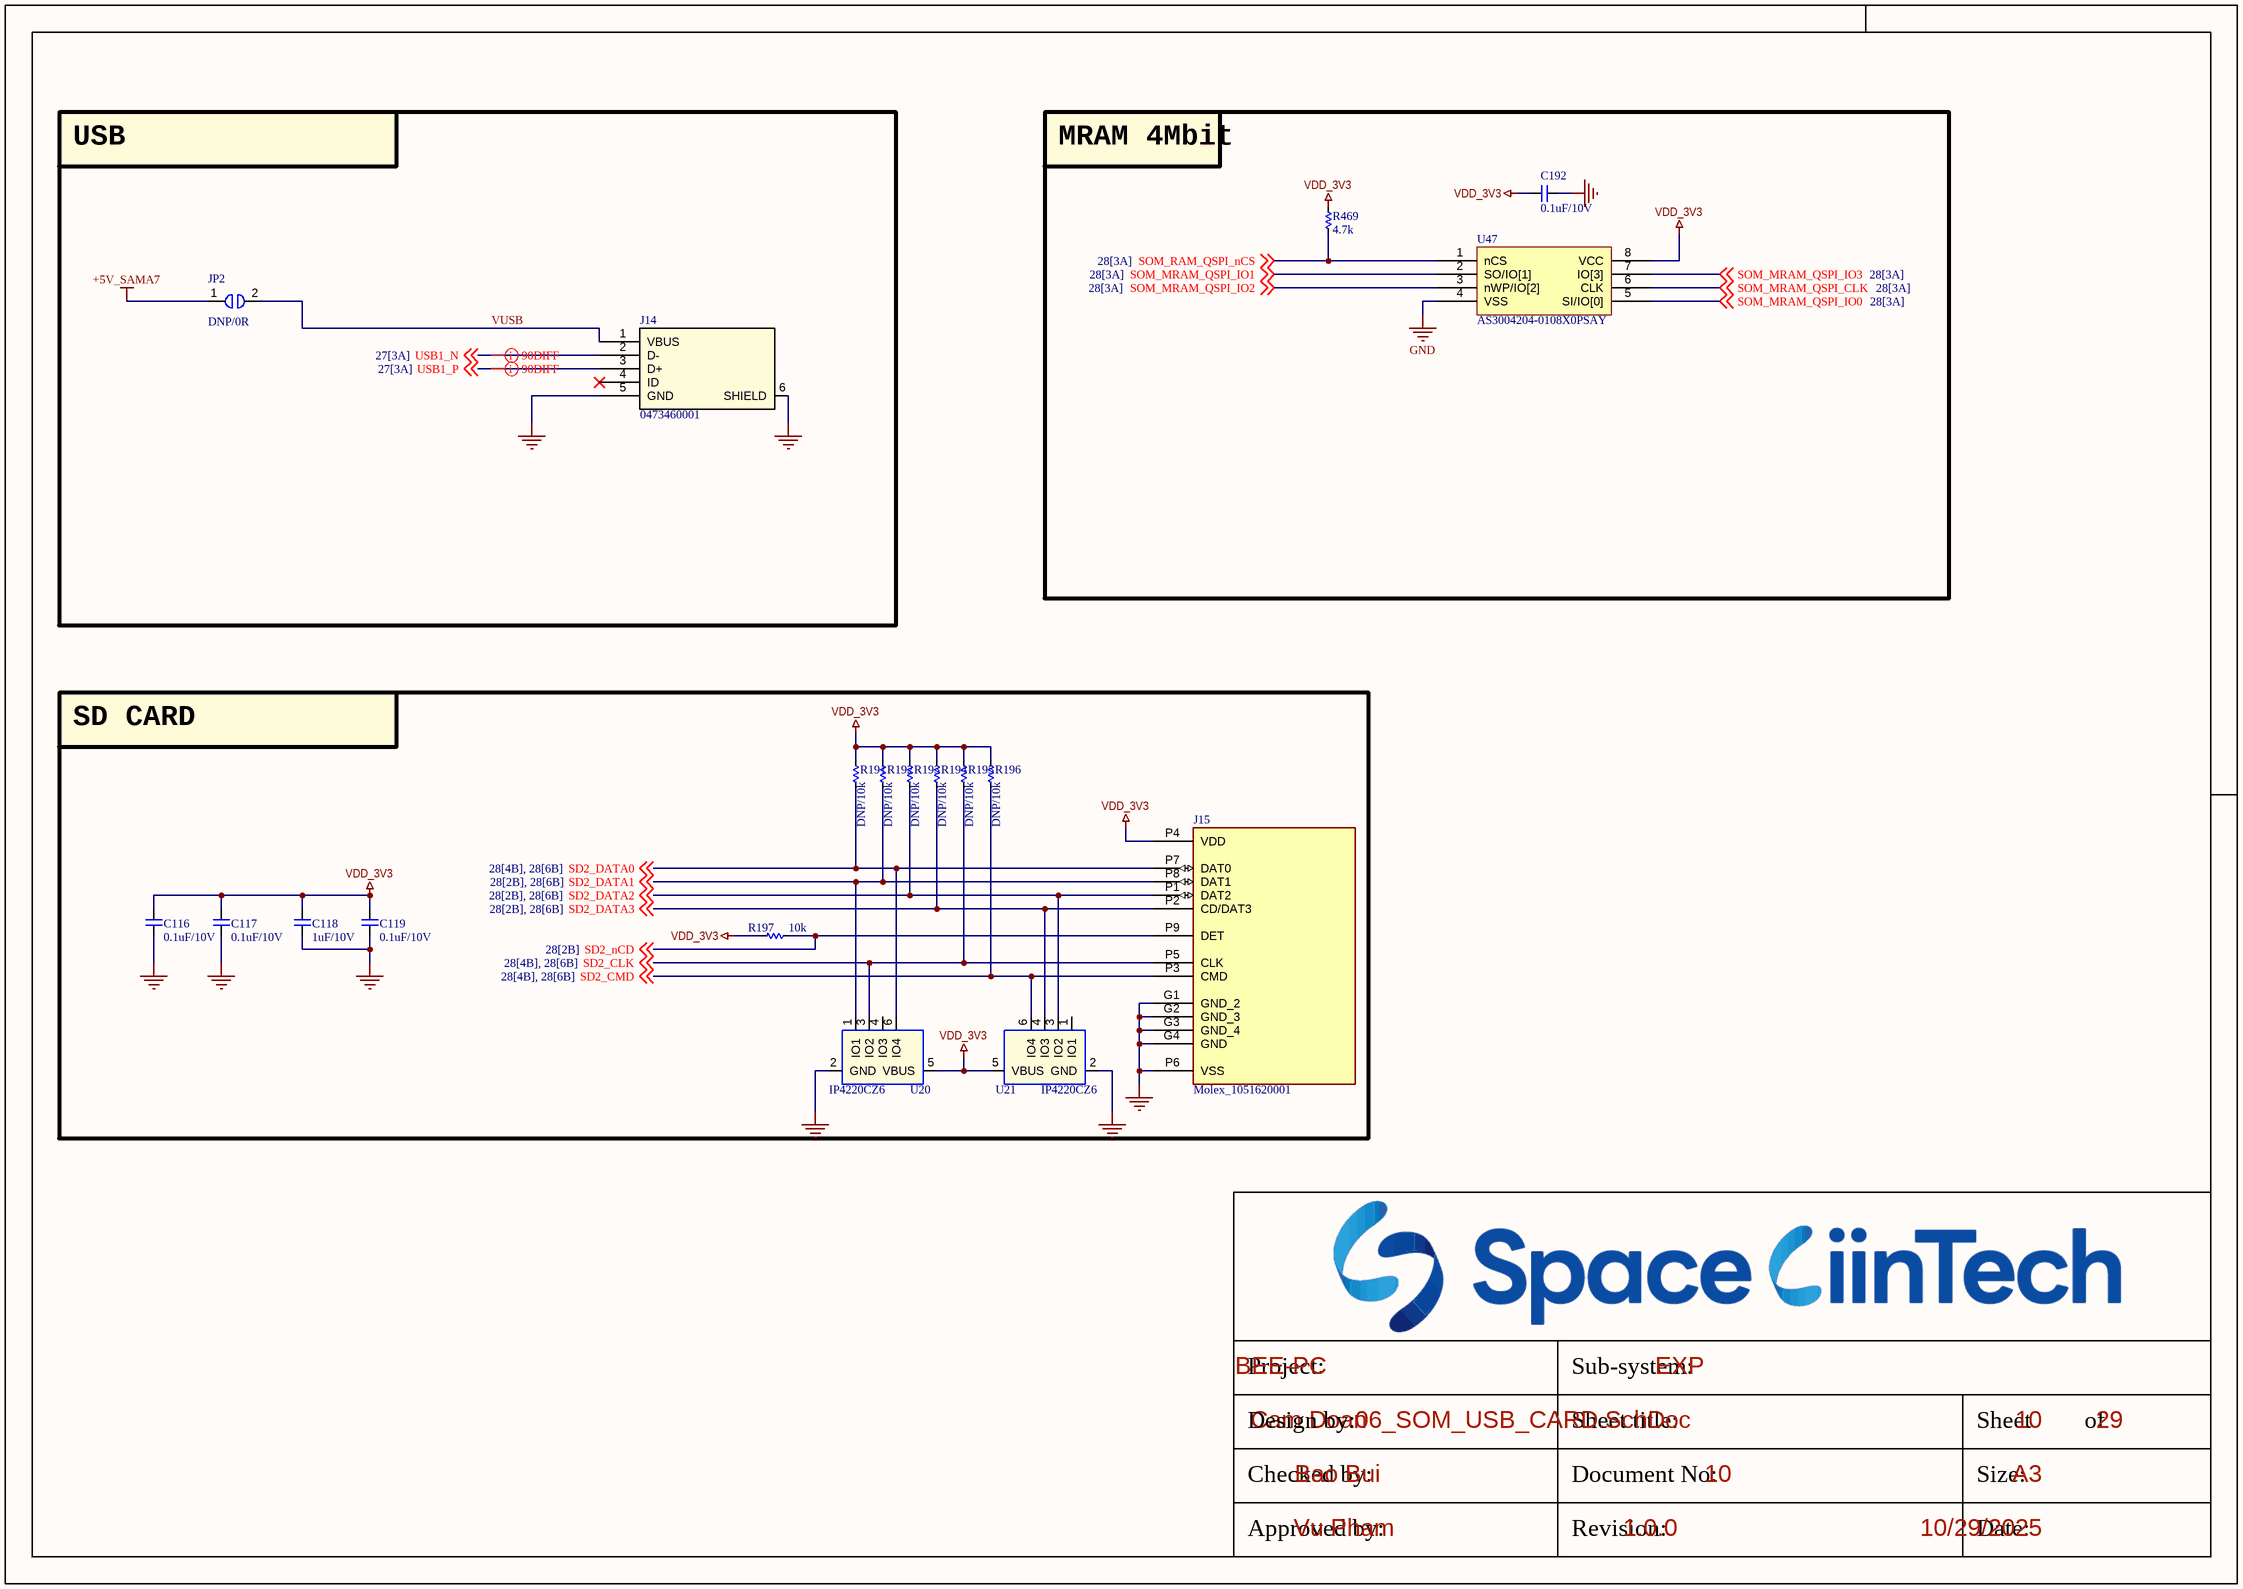
[diagram p7: 06_SOM_USB_CARD.SchDoc]

### Parts
C116  0.1uF/10V  [CAP_C_1005X60]
C117  0.1uF/10V  [CAP_C_1005X60]
C118  1uF/10V  [CAP_C_1005X60]
C119  0.1uF/10V  [CAP_C_1005X60]
C192  0.1uF/10V  [CAP_C_1005X60]
J14  0473460001  [47346-0001_MOL]
J15  Molex_1051620001  [Molex_1051620001]
JP2  DNP/0R  [RES_C_1608X60]
R191  DNP/10k  [RES_C_1005X40]
R192  DNP/10k  [RES_C_1005X40]
R193  DNP/10k  [RES_C_1005X40]
R194  DNP/10k  [RES_C_1005X40]
R195  DNP/10k  [RES_C_1005X40]
R196  DNP/10k  [RES_C_1005X40]
R197  10k  [RES_C_1005X40]
R469  4.7k  [RES_C_1005X40]
U20  IP4220CZ6  [SOT95P280X145-6N]
U21  IP4220CZ6  [SOT95P280X145-6N]
U47  AS3004204-0108X0PSAY  [SOIC127P790X216-8]

### Blocks framed on the sheet
USB: J14 JP2
MRAM 4Mbit: C192 R469 U47
SD CARD: C116-C119 J15 R191-R197 U20 U21

### Nets
+5V_SAMA7: JP2.1
GND: C116.1 C117.1 C118.1 C119.1 C192.1 J14.5(GND) J14.6(SHIELD) J15.G1(GND_2) J15.G2(GND_3) J15.G3(GND_4) J15.G4(GND) J15.P6(VSS) U20.2(GND) U21.2(GND) U47.4(VSS)
VDD_3V3: C116.2 C117.2 C118.2 C119.2 C192.2 J15.P4(VDD) R191.2 R192.2 R193.2 R194.2 R195.2 R196.2 R197.1 R469.2 U20.5(VBUS) U21.5(VBUS) U47.8(VCC)
SD2_CLK: J15.P5(CLK) R195.1 U20.3(IO2) ; off-sheet SD2_CLK
SD2_CMD: J15.P3(CMD) R196.1 U21.6(IO4) ; off-sheet SD2_CMD
SD2_DATA0: J15.P7(DAT0) R191.1 U20.6(IO4) ; off-sheet SD2_DATA0
SD2_DATA1: J15.P8(DAT1) R192.1 U20.1(IO1) ; off-sheet SD2_DATA1
SD2_DATA2: J15.P1(DAT2) R193.1 U21.3(IO2) ; off-sheet SD2_DATA2
SD2_DATA3: J15.P2(CD/DAT3) R194.1 U21.4(IO3) ; off-sheet SD2_DATA3
SD2_nCD: J15.P9(DET) R197.2 ; off-sheet SD2_nCD
SOM_MRAM_QSPI_CLK: U47.6(CLK) ; off-sheet SOM_MRAM_QSPI_CLK
SOM_MRAM_QSPI_IO0: U47.5(SI/IO[0]) ; off-sheet SOM_MRAM_QSPI_IO0
SOM_MRAM_QSPI_IO1: U47.2(SO/IO[1]) ; off-sheet SOM_MRAM_QSPI_IO1
SOM_MRAM_QSPI_IO2: U47.3(nWP/IO[2]) ; off-sheet SOM_MRAM_QSPI_IO2
SOM_MRAM_QSPI_IO3: U47.7(IO[3]) ; off-sheet SOM_MRAM_QSPI_IO3
SOM_RAM_QSPI_nCS: R469.1 U47.1(nCS) ; off-sheet SOM_RAM_QSPI_nCS
USB1_N: J14.2(D-) ; off-sheet USB1_N
USB1_P: J14.3(D+) ; off-sheet USB1_P
VUSB: J14.1(VBUS) JP2.2

Not connected (* = marked no-connect by the designer): J14 4(ID)*; U20 4(IO3); U21 1(IO1)

### Layout directives
differential pair; differential pair class DIFF90: USB1_N, USB1_P

### Notes on the sheet
- Project:
- Sub-system:
- Design by:
- Sheet title:
- Sheet
- of
- Checked by:
- Approved by:
- Revision:
- Document No:
- Size:
- Date:
- A3

### Library data of the parts
C116-C119 C192 = _CAP_C_2: CAP CHIP
J14 = USB_micro: No Description Available; Mfr_Name: Molex Connector Corporation; RefDes: RefDes; Type: Type
J15 = Molex_1051620001: 9 (8 + 1) Position Card Connector Secure Digital - microSDâ„¢ Surface Mount, Right Angle Gold; MF: Molex; SnapEDA_Link: https://www.snapeda.com/parts/1051620001/Molex/view-part/?ref=snap; Package: None; Value: *; MP: 1051620001; Check_prices: https://www.snapeda.com/parts/1051620001/Molex/view-part/?ref=eda
JP2 = JUMPER_1_1
R191-R197 R469 = _RES_B_2: RES
U20 U21 = IP4220CZ6_0: P/N: 132D42200S; PCB Footprint: SOT23-6L; CLABCONF0: =SB-UCMIMX93
U47 = IC_RAM_AS3004204-0108X0PSAY

## Sheet 06_SOM_Console.SchDoc
size 420 x 297 mm; SheetNumber: 11; SheetTotal: 29
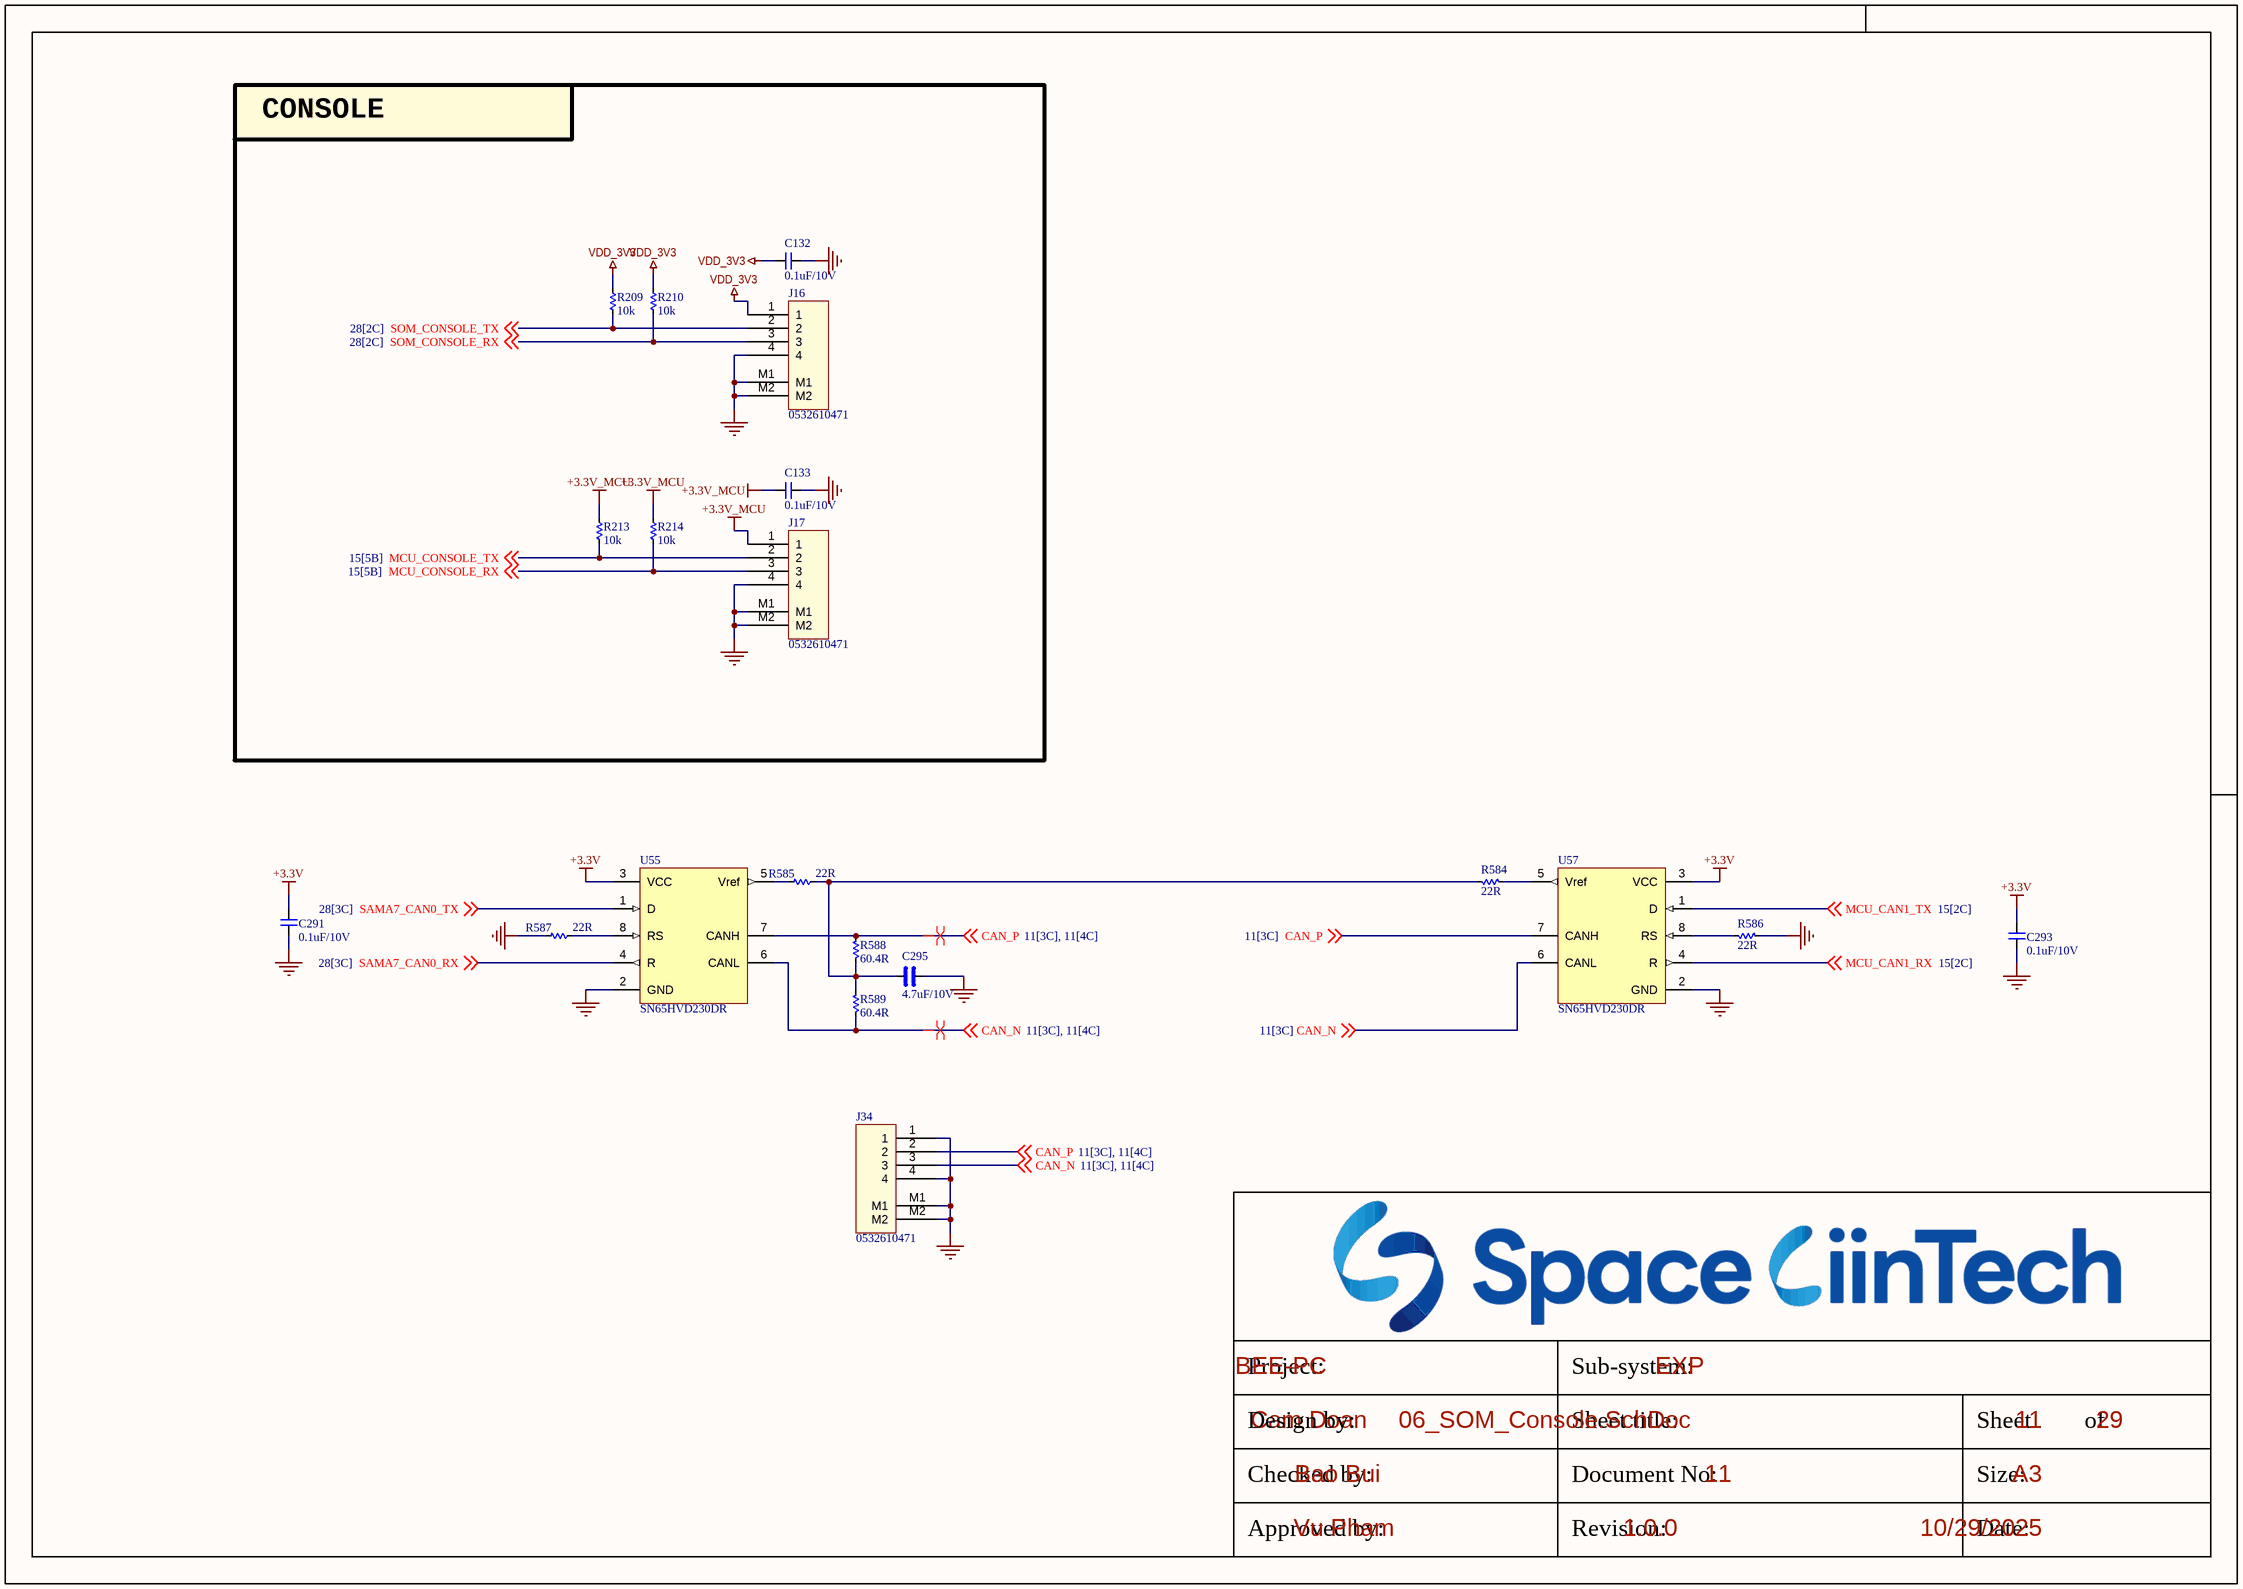
[diagram p8: 06_SOM_Console.SchDoc]

### Parts
C132  0.1uF/10V  [CAP_C_1005X60]
C133  0.1uF/10V  [CAP_C_1005X60]
C291  0.1uF/10V  [CAP_C_1005X60]
C293  0.1uF/10V  [CAP_C_1005X60]
C295  4.7uF/10V  [CAP_C_1005X60]
J16  0532610471  [MOLEX_0532610471]
J17  0532610471  [MOLEX_0532610471]
J34  0532610471  [MOLEX_0532610471]
R209  10k  [RES_C_1005X40]
R210  10k  [RES_C_1005X40]
R213  10k  [RES_C_1005X40]
R214  10k  [RES_C_1005X40]
R584  22R  [RES_C_1005X40]
R585  22R  [RES_C_1005X40]
R586  22R  [RES_C_1005X40]
R587  22R  [RES_C_1005X40]
R588  60.4R  [RES_C_1005X40]
R589  60.4R  [RES_C_1005X40]
U55  SN65HVD230DR  [SOIC127P602X173-8N]
U57  SN65HVD230DR  [SOIC127P602X173-8N]

### Blocks framed on the sheet
CONSOLE: C132 C133 J16 J17 R209 R210 R213 R214

### Nets
+3.3V: C291.2 C293.2 U55.3(VCC) U57.3(VCC)
+3.3V_MCU: C133.2 J17.1 R213.2 R214.2
GND: C132.1 C133.1 C291.1 C293.1 C295.1 J16.4 J16.M1 J16.M2 J17.4 J17.M1 J17.M2 J34.1 J34.4 J34.M1 J34.M2 R586.2 R587.2 U55.2(GND) U57.2(GND)
VDD_3V3: C132.2 J16.1 R209.2 R210.2
CAN_N: J34.3 R589.1 U55.6(CANL) U57.6(CANL) ; off-sheet CAN_N
CAN_P: J34.2 R588.2 U55.7(CANH) U57.7(CANH) ; off-sheet CAN_P
MCU_CAN1_RX: U57.4(R) ; off-sheet MCU_CAN1_RX
MCU_CAN1_TX: U57.1(D) ; off-sheet MCU_CAN1_TX
MCU_CONSOLE_RX: J17.3 R214.1 ; off-sheet MCU_CONSOLE_RX
MCU_CONSOLE_TX: J17.2 R213.1 ; off-sheet MCU_CONSOLE_TX
SAMA7_CAN0_RX: U55.4(R) ; off-sheet SAMA7_CAN0_RX
SAMA7_CAN0_TX: U55.1(D) ; off-sheet SAMA7_CAN0_TX
SOM_CONSOLE_RX: J16.3 R210.1 ; off-sheet SOM_CONSOLE_RX
SOM_CONSOLE_TX: J16.2 R209.1 ; off-sheet SOM_CONSOLE_TX
NetC295_2: C295.2 R584.1 R585.1 R588.1 R589.2
NetR584_2: R584.2 U57.5(Vref)
NetR585_2: R585.2 U55.5(Vref)
NetR586_1: R586.1 U57.8(RS)
NetR587_1: R587.1 U55.8(RS)

### Layout directives
differential pair; differential pair class DIFF: CAN_N, CAN_P

### Notes on the sheet
- Project:
- Sub-system:
- Design by:
- Sheet title:
- Sheet
- of
- Checked by:
- Approved by:
- Revision:
- Document No:
- Size:
- Date:
- A3

### Library data of the parts
C132 C133 C291 C293 = _CAP_C_2: CAP CHIP
C295 = _CAP_C_High_2: CAP CHIP High Value
J16 J17 J34 = Header 4x1_2M
R209 R210 R213 R214 R584-R589 = _RES_B_2: RES
U55 U57 = IC_CAN_SN65HVD230DR: IC TRANSCEIVER HALF 1/1 8SOIC

## Sheet 07_eMMC.SchDoc
size 420 x 297 mm; SheetNumber: 13; SheetTotal: 29
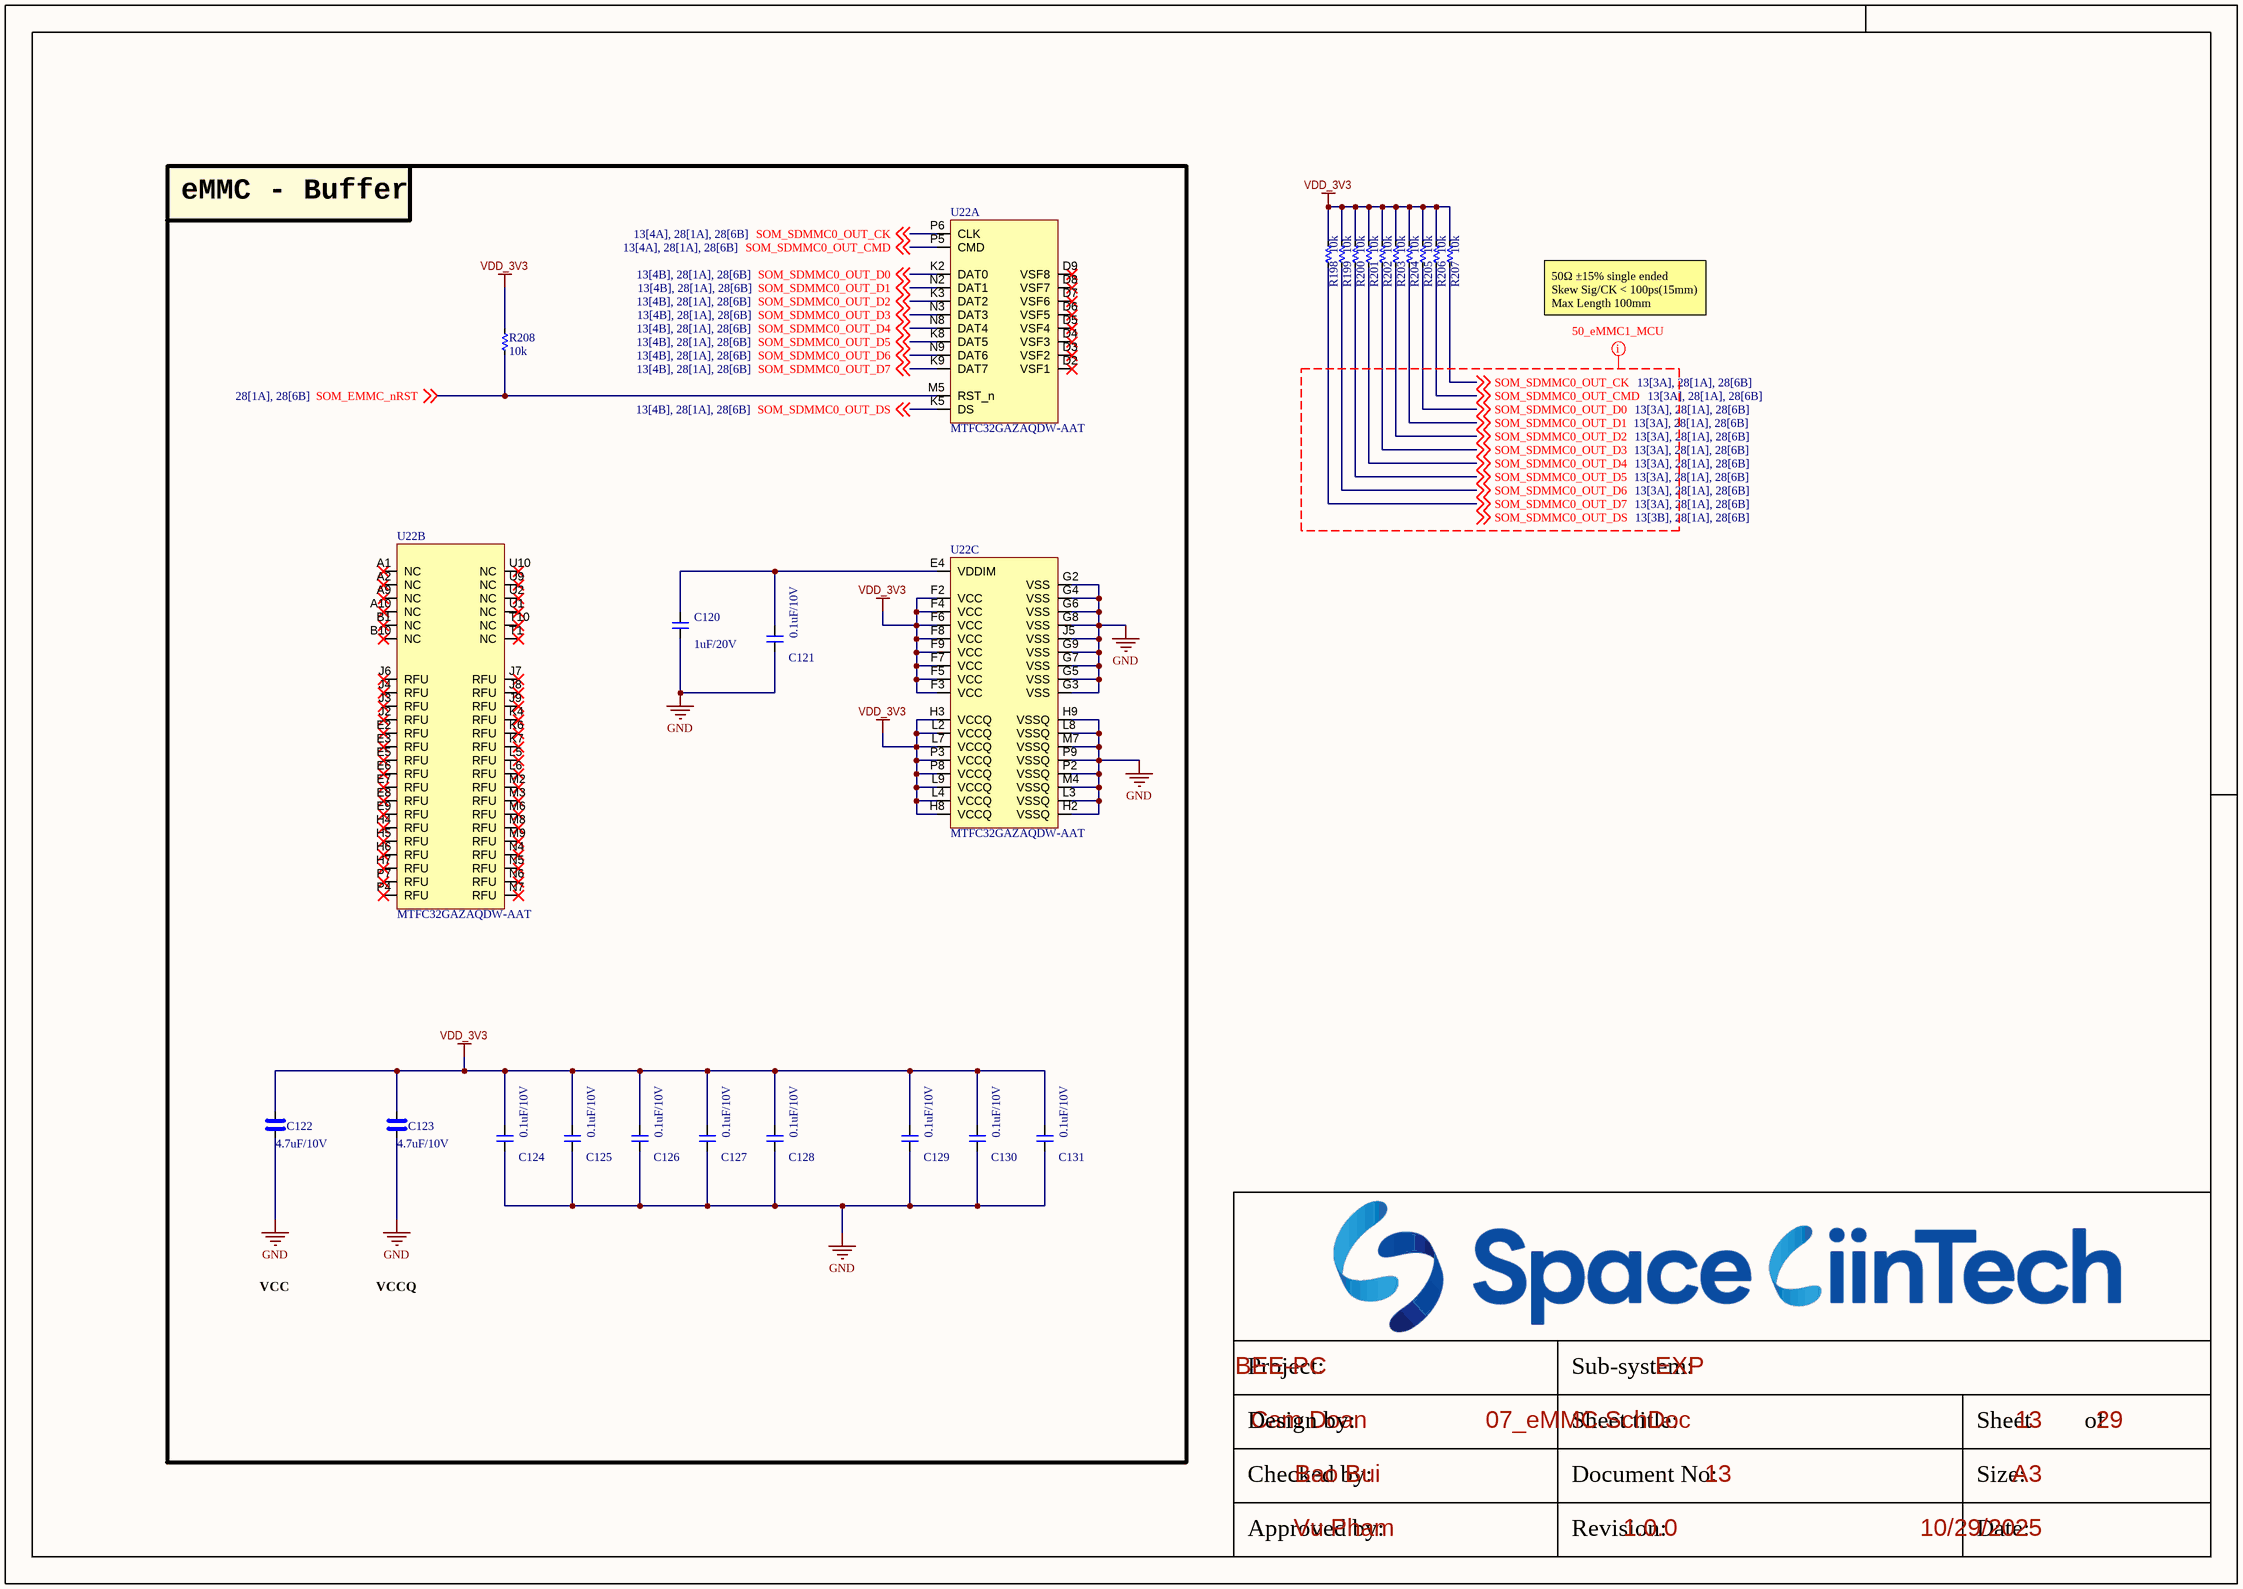
[diagram p9: 07_eMMC.SchDoc]

### Parts
C120  1uF/20V  [CAP_C_1005X60]
C121  0.1uF/10V  [CAP_C_1005X60]
C122  4.7uF/10V  [CAP_C_1005X60]
C123  4.7uF/10V  [CAP_C_1005X60]
C124  0.1uF/10V  [CAP_C_1005X60]
C125  0.1uF/10V  [CAP_C_1005X60]
C126  0.1uF/10V  [CAP_C_1005X60]
C127  0.1uF/10V  [CAP_C_1005X60]
C128  0.1uF/10V  [CAP_C_1005X60]
C129  0.1uF/10V  [CAP_C_1005X60]
C130  0.1uF/10V  [CAP_C_1005X60]
C131  0.1uF/10V  [CAP_C_1005X60]
R198  10k  [RES_C_1005X40]
R199  10k  [RES_C_1005X40]
R200  10k  [RES_C_1005X40]
R201  10k  [RES_C_1005X40]
R202  10k  [RES_C_1005X40]
R203  10k  [RES_C_1005X40]
R204  10k  [RES_C_1005X40]
R205  10k  [RES_C_1005X40]
R206  10k  [RES_C_1005X40]
R207  10k  [RES_C_1005X40]
R208  10k  [RES_C_1005X40]
U22  MTFC32GAZAQDW-AAT  [BGA_100_C_100P_10X17_1400X1800X150]  (parts A,B,C of 3)

### Blocks framed on the sheet
eMMC - Buffer: C120-C131 R208 U22

### Nets
GND: C120.1 C121.1 C122.1 C123.1 C124.1 C125.1 C126.1 C127.1 C128.1 C129.1 C130.1 C131.1 U22.G2(VSS) U22.G3(VSS) U22.G4(VSS) U22.G5(VSS) U22.G6(VSS) U22.G7(VSS) U22.G8(VSS) U22.G9(VSS) U22.H2(VSSQ) U22.H9(VSSQ) U22.J5(VSS) U22.L3(VSSQ) U22.L8(VSSQ) U22.M4(VSSQ) U22.M7(VSSQ) U22.P2(VSSQ) U22.P9(VSSQ)
VDD_3V3: C122.2 C123.2 C124.2 C125.2 C126.2 C127.2 C128.2 C129.2 C130.2 C131.2 R198.2 R199.2 R200.2 R201.2 R202.2 R203.2 R204.2 R205.2 R206.2 R207.2 R208.2 U22.F2(VCC) U22.F3(VCC) U22.F4(VCC) U22.F5(VCC) U22.F6(VCC) U22.F7(VCC) U22.F8(VCC) U22.F9(VCC) U22.H3(VCCQ) U22.H8(VCCQ) U22.L2(VCCQ) U22.L4(VCCQ) U22.L7(VCCQ) U22.L9(VCCQ) U22.P3(VCCQ) U22.P8(VCCQ)
SOM_EMMC_nRST: R208.1 U22.M5(RST_n) ; off-sheet SOM_EMMC_nRST
SOM_SDMMC0_OUT_CK: R207.1 U22.P6(CLK) ; off-sheet SOM_SDMMC0_OUT_CK
SOM_SDMMC0_OUT_CMD: R206.1 U22.P5(CMD) ; off-sheet SOM_SDMMC0_OUT_CMD
SOM_SDMMC0_OUT_D0: R205.1 U22.K2(DAT0) ; off-sheet SOM_SDMMC0_OUT_D0
SOM_SDMMC0_OUT_D1: R204.1 U22.N2(DAT1) ; off-sheet SOM_SDMMC0_OUT_D1
SOM_SDMMC0_OUT_D2: R203.1 U22.K3(DAT2) ; off-sheet SOM_SDMMC0_OUT_D2
SOM_SDMMC0_OUT_D3: R202.1 U22.N3(DAT3) ; off-sheet SOM_SDMMC0_OUT_D3
SOM_SDMMC0_OUT_D4: R201.1 U22.N8(DAT4) ; off-sheet SOM_SDMMC0_OUT_D4
SOM_SDMMC0_OUT_D5: R200.1 U22.K8(DAT5) ; off-sheet SOM_SDMMC0_OUT_D5
SOM_SDMMC0_OUT_D6: R199.1 U22.N9(DAT6) ; off-sheet SOM_SDMMC0_OUT_D6
SOM_SDMMC0_OUT_D7: R198.1 U22.K9(DAT7) ; off-sheet SOM_SDMMC0_OUT_D7
SOM_SDMMC0_OUT_DS: U22.K5(DS) ; off-sheet SOM_SDMMC0_OUT_DS
NetC120_2: C120.2 C121.2 U22.E4(VDDIM)

Not connected (* = marked no-connect by the designer): U22 A1(NC)* A2(NC)* A9(NC)* A10(NC)* B1(NC)* B10(NC)* D2(VSF1)* D3(VSF2)* D4(VSF3)* D5(VSF4)* D6(VSF5)* D7(VSF6)* D8(VSF7)* D9(VSF8)* E2(RFU)* E3(RFU)* E5(RFU)* E6(RFU)* E7(RFU)* E8(RFU)* E9(RFU)* H4(RFU)* H5(RFU)* H6(RFU)* H7(RFU)* J2(RFU)* J3(RFU)* J4(RFU)* J6(RFU)* J7(RFU)* J8(RFU)* J9(RFU)* K4(RFU)* K6(RFU)* K7(RFU)* L5(RFU)* L6(RFU)* M2(RFU)* M3(RFU)* M6(RFU)* M8(RFU)* M9(RFU)* N4(RFU)* N5(RFU)* N6(RFU)* N7(RFU)* P4(RFU)* P7(RFU)* T1(NC)* T10(NC)* U1(NC)* U2(NC)* U9(NC)* U10(NC)*

### Layout directives
net class 50_eMMC1_MCU: SOM_SDMMC0_OUT_CK, SOM_SDMMC0_OUT_CMD, SOM_SDMMC0_OUT_D0, SOM_SDMMC0_OUT_D1, SOM_SDMMC0_OUT_D2, SOM_SDMMC0_OUT_D3, SOM_SDMMC0_OUT_D4, SOM_SDMMC0_OUT_D5, SOM_SDMMC0_OUT_D6, SOM_SDMMC0_OUT_D7, SOM_SDMMC0_OUT_DS

### Notes on the sheet
- 50Ω ±15% single ended
  Skew Sig/CK < 100ps(15mm)
  Max Length 100mm
- VCC
- VCCQ
- Labels drawn without touching a wire or pin: SOM_SDMMC0_OUT_DS
- Project:
- Sub-system:
- Design by:
- Sheet title:
- Sheet
- of
- Checked by:
- Approved by:
- Revision:
- Document No:
- Size:
- Date:
- A3

### Library data of the parts
C120 C121 C124-C131 = _CAP_C_2: CAP CHIP
C122 C123 = _CAP_C_High_2: CAP CHIP High Value
R198-R208 = _RES_B_2: RES

## Sheet 07_USB.SchDoc
size 420 x 297 mm; SheetNumber: 14; SheetTotal: 28
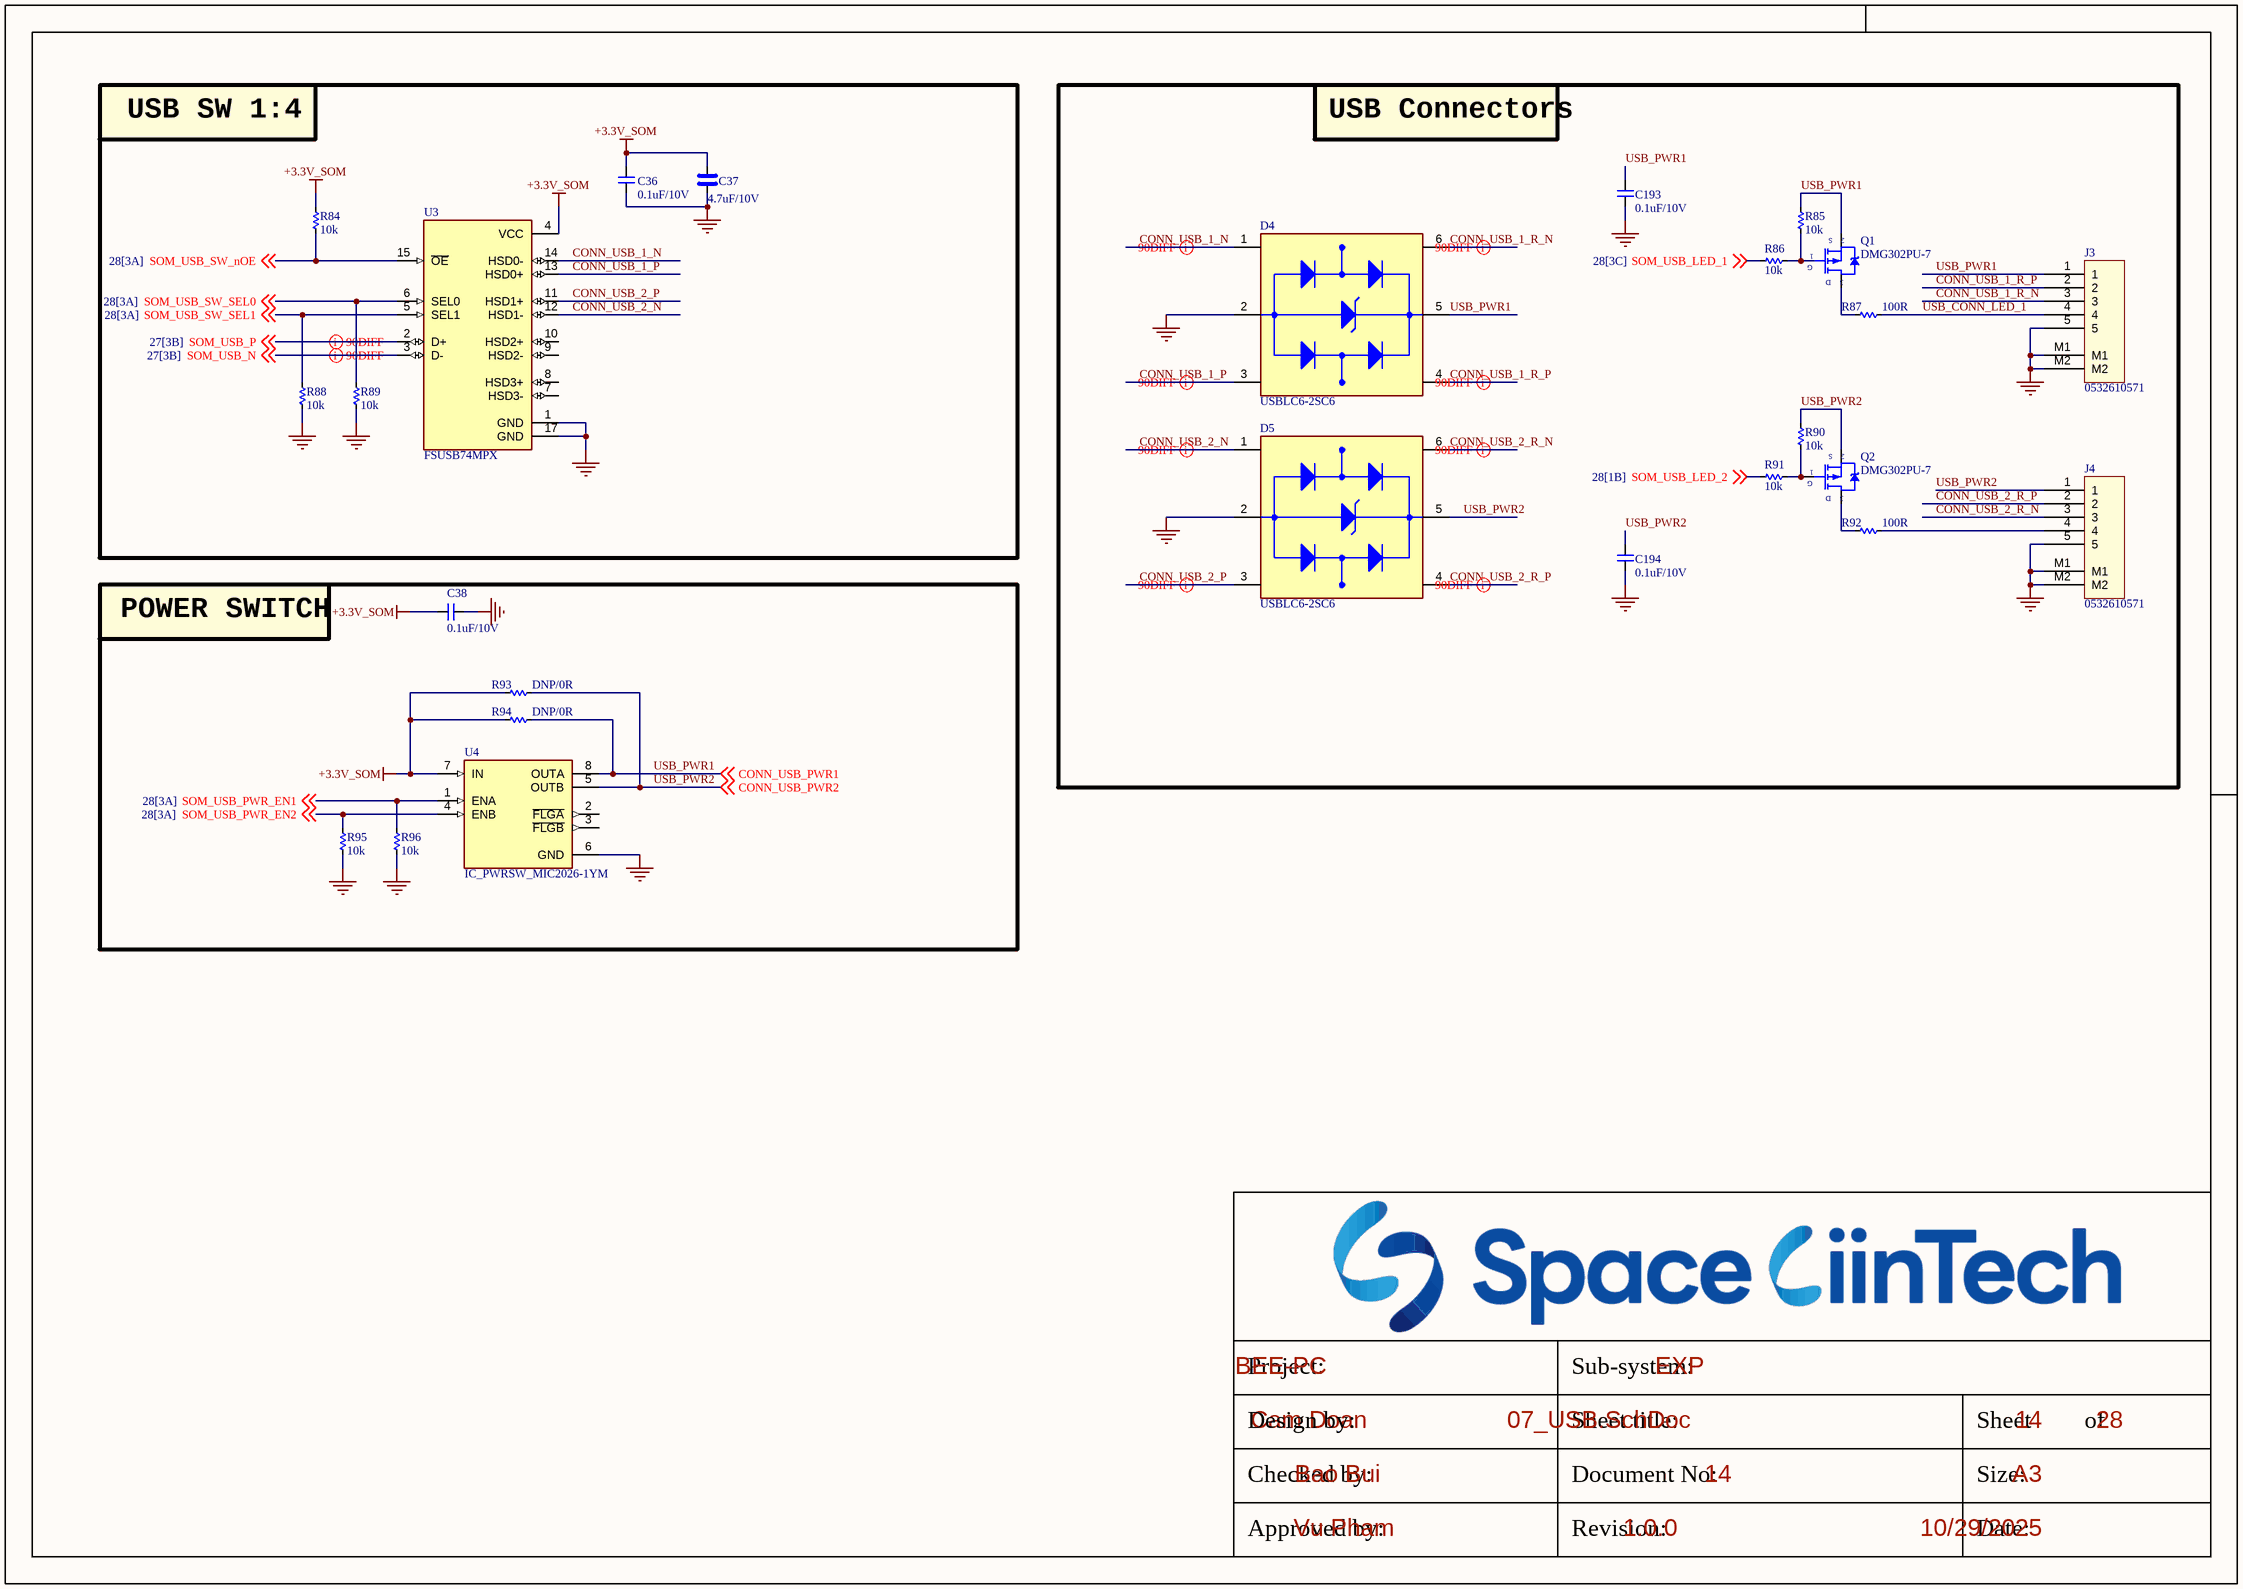
[diagram p10: 07_USB.SchDoc]

### Parts
C36  0.1uF/10V  [CAP_C_1005X60]
C37  4.7uF/10V  [CAP_C_1005X60]
C38  0.1uF/10V  [CAP_C_1005X60]
C193  0.1uF/10V  [CAP_C_1005X60]
C194  0.1uF/10V  [CAP_C_1005X60]
D4  USBLC6-2SC6  [SOT95P280X145-6N]
D5  USBLC6-2SC6  [SOT95P280X145-6N]
J3  0532610571  [MOLEX_0532610571]
J4  0532610571  [MOLEX_0532610571]
Q1  DMG302PU-7  [SOT95P240X120-3N]
Q2  DMG302PU-7  [SOT95P240X120-3N]
R84  10k  [RES_C_1005X40]
R85  10k  [RES_C_1005X40]
R86  10k  [RES_C_1005X40]
R87  100R  [RES_C_1005X40]
R88  10k  [RES_C_1005X40]
R89  10k  [RES_C_1005X40]
R90  10k  [RES_C_1005X40]
R91  10k  [RES_C_1005X40]
R92  100R  [RES_C_1005X40]
R93  DNP/0R  [RES_C_1005X40]
R94  DNP/0R  [RES_C_1005X40]
R95  10k  [RES_C_1005X40]
R96  10k  [RES_C_1005X40]
U3  FSUSB74MPX  [QFN50P300X300X80-17N]
U4  IC_PWRSW_MIC2026-1YM  [SOIC127P602X173-8N]

### Blocks framed on the sheet
USB SW 1:4: C36 C37 R84 R88 R89 U3
USB Connectors: C193 C194 D4 D5 J3 J4 Q1 Q2 R85-R87 R90-R92
POWER SWITCH: C38 R93-R96 U4

### Nets
+3.3V_SOM: C36.2 C37.2 C38.2 R84.1 R93.2 R94.2 U3.4(VCC) U4.7(IN)
GND: C36.1 C37.1 C38.1 C193.1 C194.1 D4.2(GND) D5.2(GND) J3.5 J3.M1 J3.M2 J4.5 J4.M1 J4.M2 R88.2 R89.2 R95.2 R96.2 U3.1(GND) U3.17(GND) U4.6(GND)
CONN_USB_1_N: D4.1(I/O1_IN) U3.14(HSD0-)
CONN_USB_1_P: D4.3(I/O2_IN) U3.13(HSD0+)
CONN_USB_1_R_N: D4.6(I/O1_OUT) J3.3
CONN_USB_1_R_P: D4.4(I/O2_OUT) J3.2
CONN_USB_2_N: D5.1(I/O1_IN) U3.12(HSD1-)
CONN_USB_2_P: D5.3(I/O2_IN) U3.11(HSD1+)
CONN_USB_2_R_N: D5.6(I/O1_OUT) J4.3
CONN_USB_2_R_P: D5.4(I/O2_OUT) J4.2
SOM_USB_LED_1: R86.1 ; off-sheet SOM_USB_LED_1
SOM_USB_LED_2: R91.1 ; off-sheet SOM_USB_LED_2
SOM_USB_N: U3.3(D-) ; off-sheet SOM_USB_N
SOM_USB_P: U3.2(D+) ; off-sheet SOM_USB_P
SOM_USB_PWR_EN1: R96.1 U4.1(ENA) ; off-sheet SOM_USB_PWR_EN1
SOM_USB_PWR_EN2: R95.1 U4.4(ENB) ; off-sheet SOM_USB_PWR_EN2
SOM_USB_SW_nOE: R84.2 U3.15(~{OE}) ; off-sheet SOM_USB_SW_nOE
SOM_USB_SW_SEL0: R89.1 U3.6(SEL0) ; off-sheet SOM_USB_SW_SEL0
SOM_USB_SW_SEL1: R88.1 U3.5(SEL1) ; off-sheet SOM_USB_SW_SEL1
USB_CONN_LED_1: J3.4 R87.2
USB_PWR1: C193.2 D4.5(VBUS) J3.1 Q1.2(S) R85.1 R94.1 U4.8(OUTA) ; off-sheet CONN_USB_PWR1  [also labelled CONN_USB_PWR1]
USB_PWR2: C194.2 D5.5(VBUS) J4.1 Q2.2(S) R90.1 R93.1 U4.5(OUTB) ; off-sheet CONN_USB_PWR2  [also labelled CONN_USB_PWR2]
NetJ4_4: J4.4 R92.2
NetQ1_1: Q1.1(G) R85.2 R86.2
NetQ1_3: Q1.3(D) R87.1
NetQ2_1: Q2.1(G) R90.2 R91.2
NetQ2_3: Q2.3(D) R92.1

Not connected (* = marked no-connect by the designer): U3 7(HSD3-) 8(HSD3+) 9(HSD2-) 10(HSD2+); U4 2(~{FLGA}) 3(~{FLGB})

### Layout directives
differential pair; differential pair class DIFF90: CONN_USB_1_N, CONN_USB_1_P, CONN_USB_1_R_N, CONN_USB_1_R_P, CONN_USB_2_N, CONN_USB_2_P, CONN_USB_2_R_N, CONN_USB_2_R_P, SOM_USB_N, SOM_USB_P

### Notes on the sheet
- Project:
- Sub-system:
- Design by:
- Sheet title:
- Sheet
- of
- Checked by:
- Approved by:
- Revision:
- Document No:
- Size:
- Date:
- A3

### Library data of the parts
C36 C38 C193 C194 = _CAP_C_2: CAP CHIP
C37 = _CAP_C_High_2: CAP CHIP High Value
D4 D5 = USBLC6-2SC6: as D2 on sheet 04_CONNECTOR_IN; Value: *; SnapEDA_Link: https://www.snapeda.com/parts/USBLC6-2SC6/STMicroelectronics/view-part/?ref=snap; Check_prices: https://www.snapeda.com/parts/USBLC6-2SC6/STMicroelectronics/view-part/?ref=eda; Purchase-URL: https://pricing.snapeda.com/search/part/USBLC6-2SC6/?ref=eda; Price: None; Availability: In Stock; Package: SOT-23-6 STMicroelectronics; MP: USBLC6-2SC6
J3 J4 = Header 5x1_2M
Q1 Q2 = MOSFET_P_GSD
R84-R96 = _RES_B_2: RES
U3 = IC_USB_SW_FSUSB74MPX: USB Switch IC 1 Channel 16-MLP (3x3); MF: ON Semiconductor; SnapEDA_Link: https://www.snapeda.com/parts/FSUSB74MPX/Onsemi/view-part/?ref=snap; Package: WQFN-16 ON Semiconductor; Value: *; MP: FSUSB74MPX; Check_prices: https://www.snapeda.com/parts/FSUSB74MPX/Onsemi/view-part/?ref=eda
U4 = IC_PWRSW_MIC2026-1YM: Power Switch/Driver 1:2 N-Channel 1.25A 8-SOIC; MF: Microchip; SnapEDA_Link: https://www.snapeda.com/parts/MIC2026-1YM/Microchip/view-part/?ref=snap; Package: SO-8 Microchip; Value: *; MP: MIC2026-1YM; Check_prices: https://www.snapeda.com/parts/MIC2026-1YM/Microchip/view-part/?ref=eda